# EAGLE design module_state (EAGLE 6.5.0)

## Sheet 1 of 8
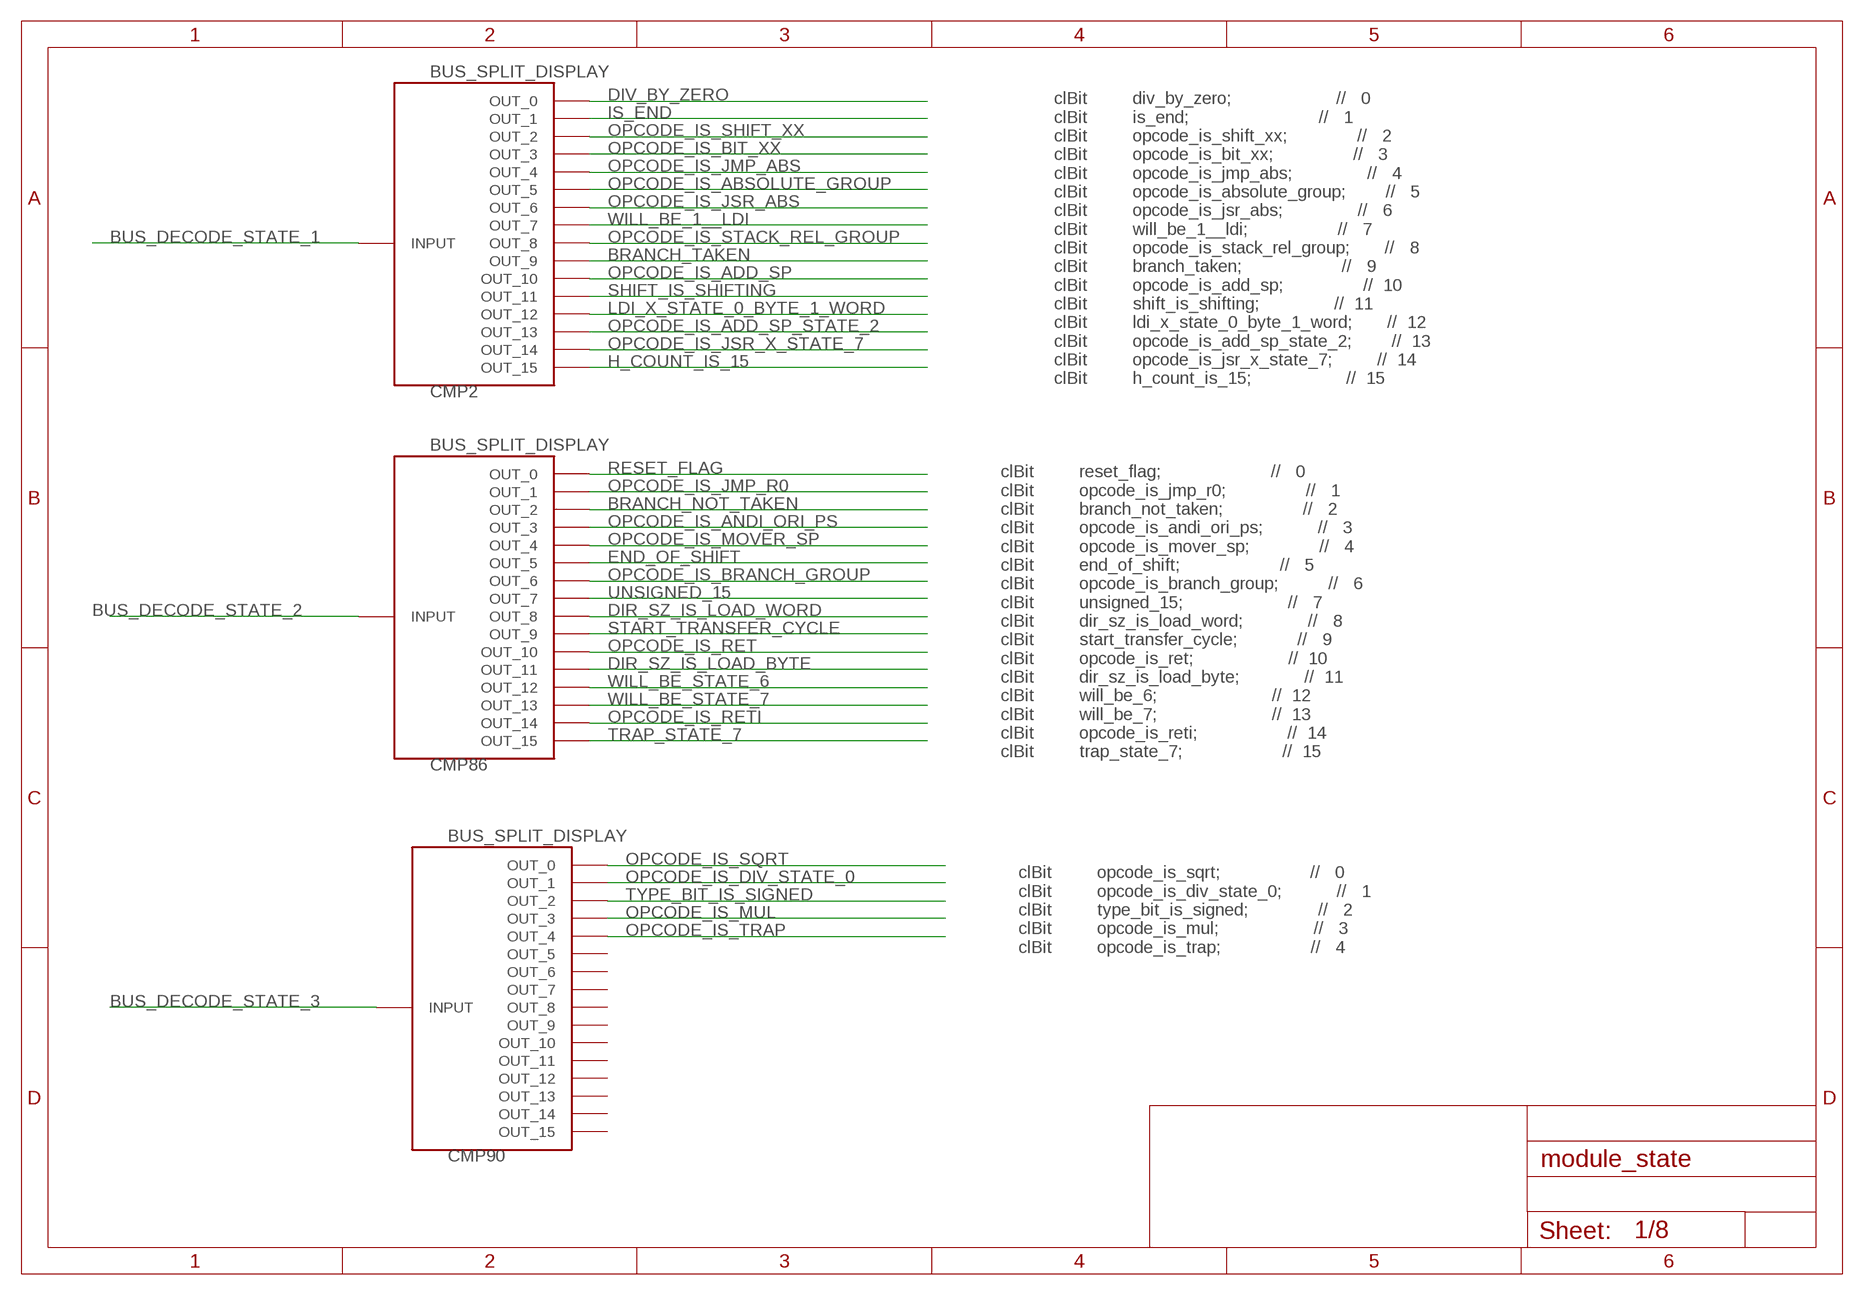
[diagram p0: schematic, sheet 1]

### Parts
CMP2  BUS_SPLIT_DISPLAY  [BUS_SPLIT_DISPLAY]
CMP86  BUS_SPLIT_DISPLAY  [BUS_SPLIT_DISPLAY]
CMP90  BUS_SPLIT_DISPLAY  [BUS_SPLIT_DISPLAY]

### Nets
BRANCH_NOT_TAKEN: CMP86.P$3(OUT_2) ; also sheet 4
BRANCH_TAKEN: CMP2.P$10(OUT_9) ; also sheet 3
BUS_DECODE_STATE_1: CMP2.INPUT
BUS_DECODE_STATE_2: CMP86.INPUT
BUS_DECODE_STATE_3: CMP90.INPUT
DIR_SZ_IS_LOAD_BYTE: CMP86.P$12(OUT_11) ; also sheet 6
DIR_SZ_IS_LOAD_WORD: CMP86.P$9(OUT_8) ; also sheet 6
DIV_BY_ZERO: CMP2.P$1(OUT_0) ; also sheet 3,7
END_OF_SHIFT: CMP86.P$6(OUT_5) ; also sheet 4
H_COUNT_IS_15: CMP2.P$16(OUT_15) ; also sheet 5,7
IS_END: CMP2.P$2(OUT_1) ; also sheet 3
LDI_X_STATE_0_BYTE_1_WORD: CMP2.P$13(OUT_12) ; also sheet 5
OPCODE_IS_ABSOLUTE_GROUP: CMP2.P$6(OUT_5) ; also sheet 3,4
OPCODE_IS_ADD_SP: CMP2.P$11(OUT_10) ; also sheet 3
OPCODE_IS_ADD_SP_STATE_2: CMP2.P$14(OUT_13) ; also sheet 5
OPCODE_IS_ANDI_ORI_PS: CMP86.P$4(OUT_3) ; also sheet 4
OPCODE_IS_BIT_XX: CMP2.P$4(OUT_3) ; also sheet 3,5
OPCODE_IS_BRANCH_GROUP: CMP86.P$7(OUT_6) ; also sheet 4
OPCODE_IS_DIV_STATE_0: CMP90.P$2(OUT_1) ; also sheet 7
OPCODE_IS_JMP_ABS: CMP2.P$5(OUT_4) ; also sheet 3,4
OPCODE_IS_JMP_R0: CMP86.P$2(OUT_1) ; also sheet 4
OPCODE_IS_JSR_ABS: CMP2.P$7(OUT_6) ; also sheet 3,8
OPCODE_IS_JSR_X_STATE_7: CMP2.P$15(OUT_14) ; also sheet 5
OPCODE_IS_MOVER_SP: CMP86.P$5(OUT_4) ; also sheet 4
OPCODE_IS_MUL: CMP90.P$4(OUT_3) ; also sheet 7
OPCODE_IS_RET: CMP86.P$11(OUT_10) ; also sheet 4,6
OPCODE_IS_RETI: CMP86.P$15(OUT_14) ; also sheet 4,6
OPCODE_IS_SHIFT_XX: CMP2.P$3(OUT_2) ; also sheet 3
OPCODE_IS_SQRT: CMP90.P$1(OUT_0) ; also sheet 7
OPCODE_IS_STACK_REL_GROUP: CMP2.P$9(OUT_8) ; also sheet 3
OPCODE_IS_TRAP: CMP90.P$5(OUT_4) ; also sheet 8
RESET_FLAG: CMP86.P$1(OUT_0) ; also sheet 4,8
SHIFT_IS_SHIFTING: CMP2.P$12(OUT_11) ; also sheet 3
START_TRANSFER_CYCLE: CMP86.P$10(OUT_9) ; also sheet 6
TRAP_STATE_7: CMP86.P$16(OUT_15) ; also sheet 2
TYPE_BIT_IS_SIGNED: CMP90.P$3(OUT_2) ; also sheet 7,8
UNSIGNED_15: CMP86.P$8(OUT_7) ; also sheet 5
WILL_BE_1__LDI: CMP2.P$8(OUT_7) ; also sheet 3
WILL_BE_STATE_6: CMP86.P$13(OUT_12) ; also sheet 2
WILL_BE_STATE_7: CMP86.P$14(OUT_13) ; also sheet 2
Unconnected: CMP90.P$6(OUT_5) CMP90.P$7(OUT_6) CMP90.P$8(OUT_7) CMP90.P$9(OUT_8) CMP90.P$10(OUT_9) CMP90.P$11(OUT_10) CMP90.P$12(OUT_11) CMP90.P$13(OUT_12) CMP90.P$14(OUT_13) CMP90.P$15(OUT_14) CMP90.P$16(OUT_15)

### Notes on the sheet
- clBit         div_by_zero;                     //   0
      clBit         is_end;                          //   1
      clBit         opcode_is_shift_xx;              //   2
      clBit         opcode_is_bit_xx;                //   3
      clBit         opcode_is_jmp_abs;               //   4
      clBit         opcode_is_absolute_group;        //   5
      clBit         opcode_is_jsr_abs;               //   6
      clBit         will_be_1__ldi;                  //   7
      clBit         opcode_is_stack_rel_group;       //   8
      clBit         branch_taken;                    //   9
      clBit         opcode_is_add_sp;                //  10
      clBit         shift_is_shifting;               //  11
      clBit         ldi_x_state_0_byte_1_word;       //  12
      clBit         opcode_is_add_sp_state_2;        //  13
      clBit         opcode_is_jsr_x_state_7;         //  14
      clBit         h_count_is_15;                   //  15
- clBit         reset_flag;                      //   0
      clBit         opcode_is_jmp_r0;                //   1
      clBit         branch_not_taken;                //   2
      clBit         opcode_is_andi_ori_ps;           //   3
      clBit         opcode_is_mover_sp;              //   4
      clBit         end_of_shift;                    //   5
      clBit         opcode_is_branch_group;          //   6
      clBit         unsigned_15;                     //   7
      clBit         dir_sz_is_load_word;             //   8
      clBit         start_transfer_cycle;            //   9
      clBit         opcode_is_ret;                   //  10
      clBit         dir_sz_is_load_byte;             //  11
      clBit         will_be_6;                       //  12
      clBit         will_be_7;                       //  13
      clBit         opcode_is_reti;                  //  14
      clBit         trap_state_7;                    //  15
- clBit         opcode_is_sqrt;                  //   0
      clBit         opcode_is_div_state_0;           //   1
      clBit         type_bit_is_signed;              //   2
      clBit         opcode_is_mul;                   //   3
      clBit         opcode_is_trap;                  //   4

## Sheet 2 of 8
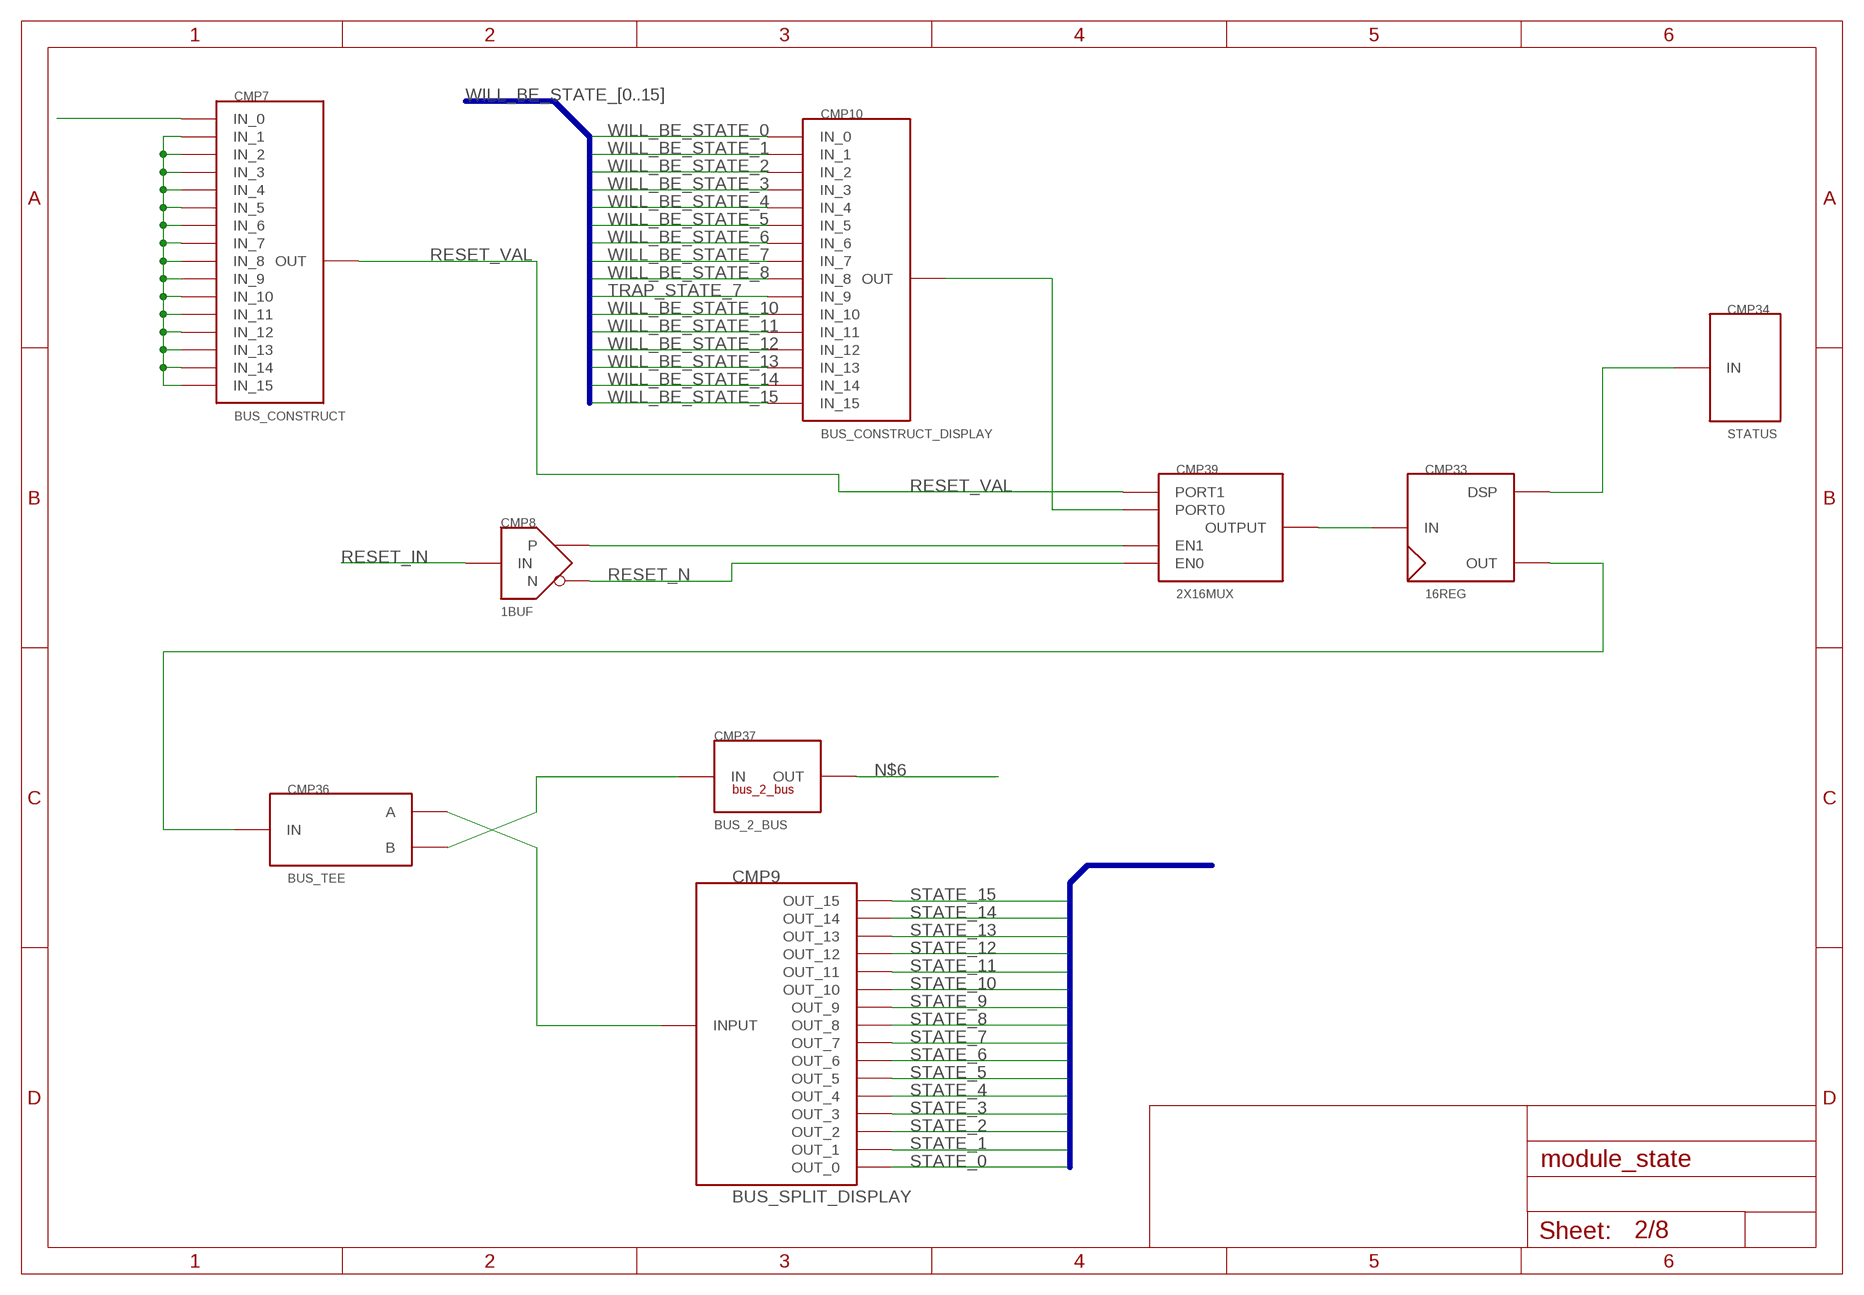
[diagram p1: schematic, sheet 2]

### Parts
CMP7  BUS_CONSTRUCT  [BUS_SPLIT]
CMP8  1BUF  [1BUF]
CMP9  BUS_SPLIT_DISPLAY  [BUS_SPLIT_DISPLAY]
CMP10  BUS_CONSTRUCT_DISPLAY  [BUS_SPLIT_DISPLAY]
CMP33  16REG  [16REG]
CMP34  STATUS  [STATUS]
CMP36  BUS_TEE  [BUS_TEE]
CMP37  BUS_2_BUS  [BUS2BUS]
CMP39  2X16MUX  [2X16MUX]

### Nets
N$1: CMP33.DISPLAY(DSP) CMP34.P$1(IN)
N$2: CMP33.OUT CMP36.INPUT(IN)
N$3: CMP36.OUTB(B) CMP37.P$1(IN)
N$4: CMP7.P$1(IN_0)
N$5: CMP7.P$2(IN_1) CMP7.P$3(IN_2) CMP7.P$4(IN_3) CMP7.P$5(IN_4) CMP7.P$6(IN_5) CMP7.P$7(IN_6) CMP7.P$8(IN_7) CMP7.P$9(IN_8) CMP7.P$10(IN_9) CMP7.P$11(IN_10) CMP7.P$12(IN_11) CMP7.P$13(IN_12) CMP7.P$14(IN_13) CMP7.P$15(IN_14) CMP7.P$16(IN_15)
N$6: CMP37.P$2(OUT)
N$7: CMP9.INPUT CMP36.OUT_A(A)
N$8: CMP10.INPUT(OUT) CMP39.PORT0
N$9: CMP33.INPUT(IN) CMP39.OUT(OUTPUT)
N$13: CMP8.P CMP39.EN1
RESET_IN: CMP8.IN
RESET_N: CMP8.N CMP39.EN0
RESET_VAL: CMP7.INPUT(OUT) CMP39.PORT1
STATE_0: CMP9.P$1(OUT_0) ; also sheet 3,5,6,7,8
STATE_1: CMP9.P$2(OUT_1) ; also sheet 3,5,8
STATE_2: CMP9.P$3(OUT_2) ; also sheet 5
STATE_3: CMP9.P$4(OUT_3)
STATE_4: CMP9.P$5(OUT_4) ; also sheet 6
STATE_5: CMP9.P$6(OUT_5) ; also sheet 4,5
STATE_6: CMP9.P$7(OUT_6)
STATE_7: CMP9.P$8(OUT_7) ; also sheet 4
STATE_8: CMP9.P$9(OUT_8) ; also sheet 6
STATE_9: CMP9.P$10(OUT_9) ; also sheet 5
STATE_10: CMP9.P$11(OUT_10) ; also sheet 5,7
STATE_11: CMP9.P$12(OUT_11) ; also sheet 5,7
STATE_12: CMP9.P$13(OUT_12) ; also sheet 5
STATE_13: CMP9.P$14(OUT_13) ; also sheet 5,7,8
STATE_14: CMP9.P$15(OUT_14) ; also sheet 5
STATE_15: CMP9.P$16(OUT_15)
TRAP_STATE_7: CMP10.P$10(IN_9) ; also sheet 1
WILL_BE_STATE_0: CMP10.P$1(IN_0) ; also sheet 3
WILL_BE_STATE_1: CMP10.P$2(IN_1) ; also sheet 3
WILL_BE_STATE_2: CMP10.P$3(IN_2) ; also sheet 3
WILL_BE_STATE_3: CMP10.P$4(IN_3) ; also sheet 5
WILL_BE_STATE_4: CMP10.P$5(IN_4) ; also sheet 6
WILL_BE_STATE_5: CMP10.P$6(IN_5) ; also sheet 6
WILL_BE_STATE_6: CMP10.P$7(IN_6) ; also sheet 1
WILL_BE_STATE_7: CMP10.P$8(IN_7) ; also sheet 1
WILL_BE_STATE_8: CMP10.P$9(IN_8) ; also sheet 6
WILL_BE_STATE_10: CMP10.P$11(IN_10) ; also sheet 7
WILL_BE_STATE_11: CMP10.P$12(IN_11) ; also sheet 7
WILL_BE_STATE_12: CMP10.P$13(IN_12) ; also sheet 7
WILL_BE_STATE_13: CMP10.P$14(IN_13) ; also sheet 7
WILL_BE_STATE_14: CMP10.P$15(IN_14) ; also sheet 8
WILL_BE_STATE_15: CMP10.P$16(IN_15) ; also sheet 8

### Buses
WILL_BE_STATE_[0..15]
STATE_[0..15]

## Sheet 3 of 8
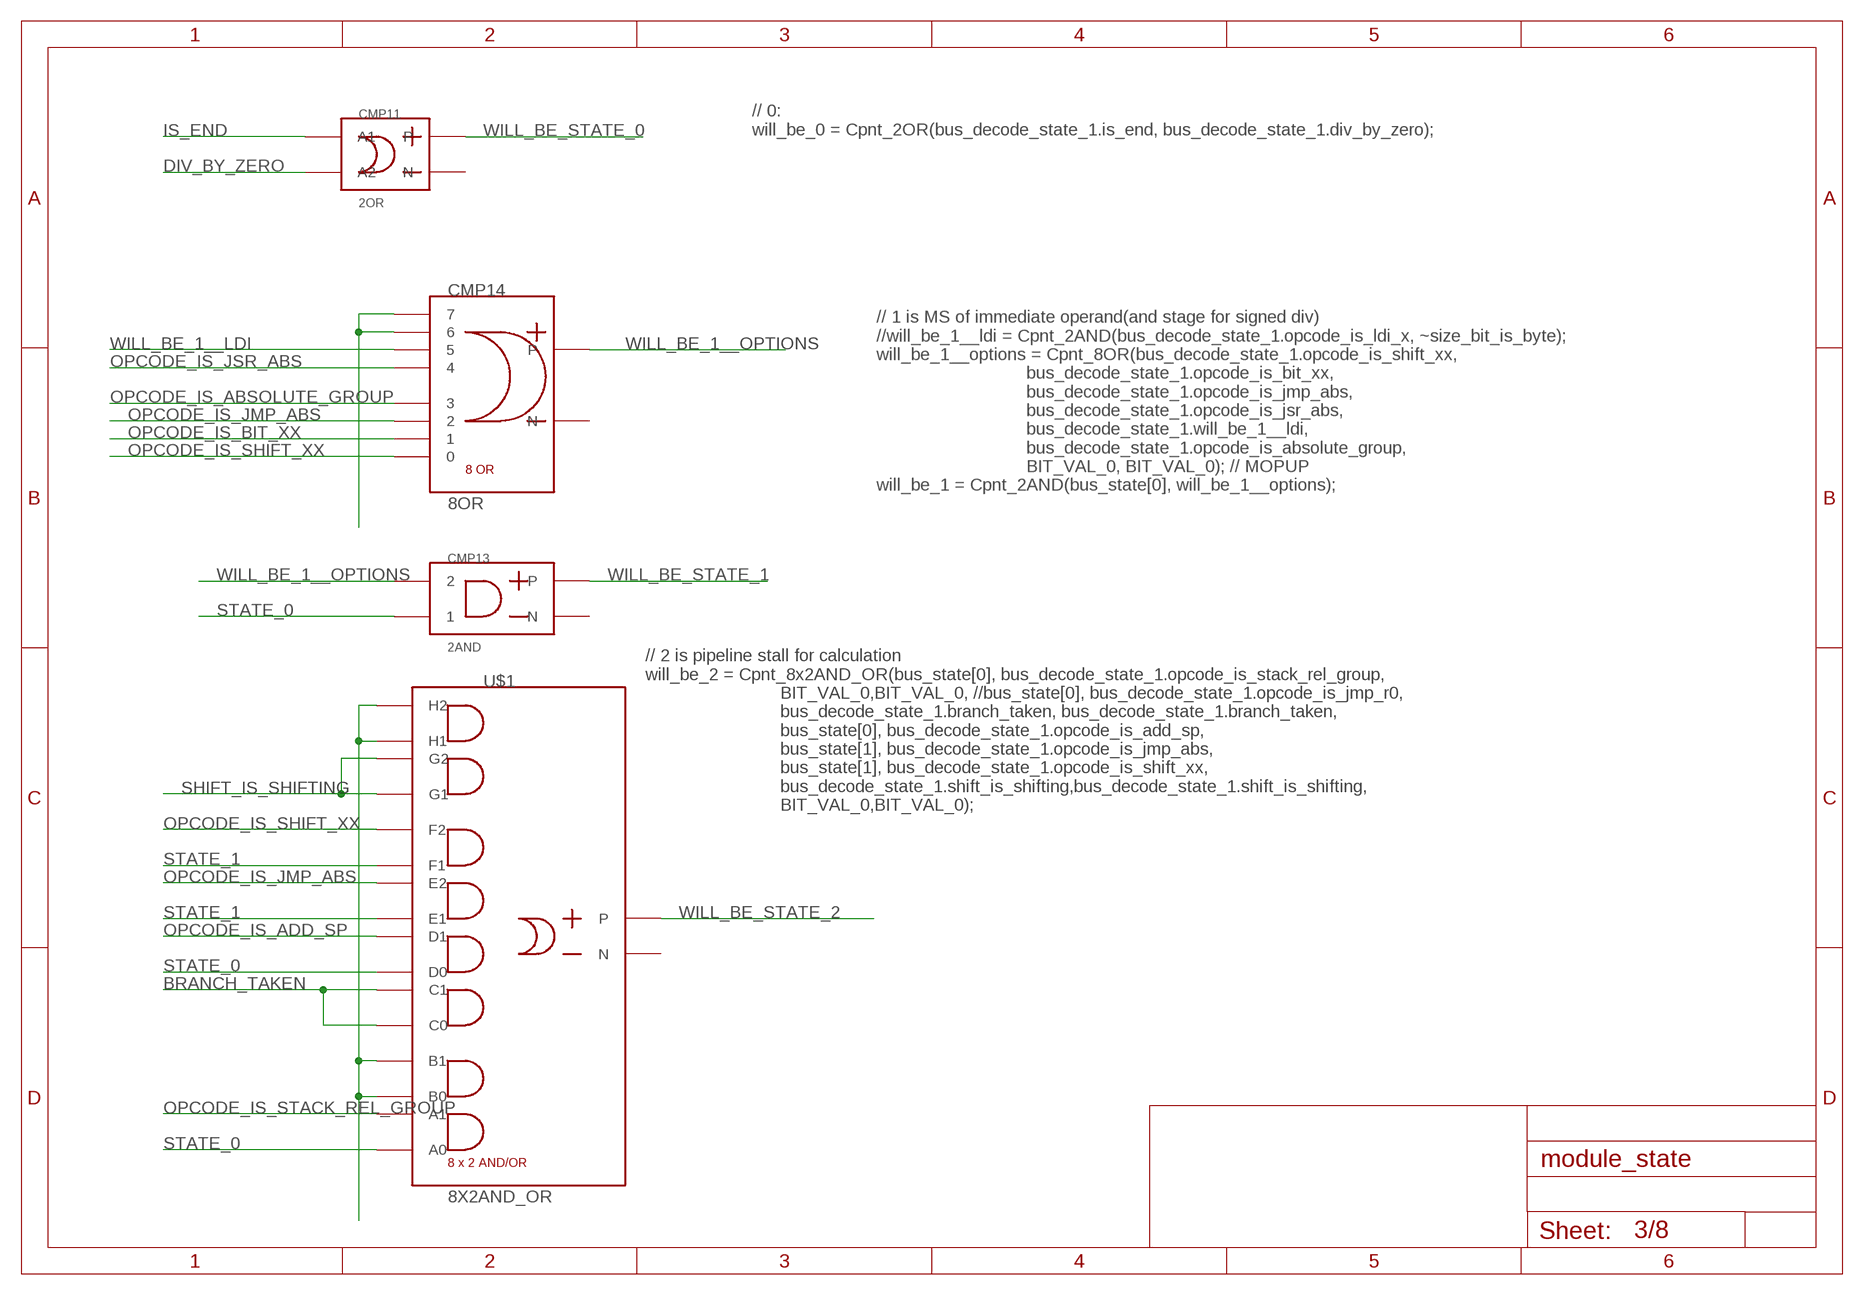
[diagram p2: schematic, sheet 3]

### Parts
CMP11  2OR  [2OR]
CMP13  2AND  [2AND]
CMP14  8OR  [8OR]
U$1  8X2AND_OR  [8X2AND_OR]

### Nets
BRANCH_TAKEN: U$1.P$5(C0) U$1.P$6(C1) ; also sheet 1
DIV_BY_ZERO: CMP11.P$1(A2) ; also sheet 1,7
IS_END: CMP11.P$2(A1) ; also sheet 1
N$10: U$1.P$3(B0) U$1.P$4(B1) U$1.P$15(H1) U$1.P$16(H2)
N$11: CMP14.7 CMP14.8
OPCODE_IS_ABSOLUTE_GROUP: CMP14.4 ; also sheet 1,4
OPCODE_IS_ADD_SP: U$1.P$8(D1) ; also sheet 1
OPCODE_IS_BIT_XX: CMP14.2 ; also sheet 1,5
OPCODE_IS_JMP_ABS: CMP14.3 U$1.P$10(E2) ; also sheet 1,4
OPCODE_IS_JSR_ABS: CMP14.5 ; also sheet 1,8
OPCODE_IS_SHIFT_XX: CMP14.1 U$1.P$12(F2) ; also sheet 1
OPCODE_IS_STACK_REL_GROUP: U$1.P$2(A1) ; also sheet 1
SHIFT_IS_SHIFTING: U$1.P$13(G1) U$1.P$14(G2) ; also sheet 1
STATE_0: CMP13.P$1 U$1.P$1(A0) U$1.P$7(D0) ; also sheet 2,5,6,7,8
STATE_1: U$1.P$9(E1) U$1.P$11(F1) ; also sheet 2,5,8
WILL_BE_1__LDI: CMP14.6 ; also sheet 1
WILL_BE_1__OPTIONS: CMP13.P$2 CMP14.OUT_P(P)
WILL_BE_STATE_0: CMP11.OUT_P(P) ; also sheet 2
WILL_BE_STATE_1: CMP13.OUT_P(P) ; also sheet 2
WILL_BE_STATE_2: U$1.OUT_P(P) ; also sheet 2
Unconnected: CMP11.OUT_M(N) CMP13.OUT_M(N) CMP14.OUT_M(N) U$1.OUT_M(N)

### Notes on the sheet
- // 0:
      will_be_0 = Cpnt_2OR(bus_decode_state_1.is_end, bus_decode_state_1.div_by_zero);
- // 1 is MS of immediate operand(and stage for signed div)
      //will_be_1__ldi = Cpnt_2AND(bus_decode_state_1.opcode_is_ldi_x, ~size_bit_is_byte);
      will_be_1__options = Cpnt_8OR(bus_decode_state_1.opcode_is_shift_xx,
                                    bus_decode_state_1.opcode_is_bit_xx,
                                    bus_decode_state_1.opcode_is_jmp_abs,
                                    bus_decode_state_1.opcode_is_jsr_abs,
                                    bus_decode_state_1.will_be_1__ldi,
                                    bus_decode_state_1.opcode_is_absolute_group,
                                    BIT_VAL_0, BIT_VAL_0); // MOPUP
      will_be_1 = Cpnt_2AND(bus_state[0], will_be_1__options);
- // 2 is pipeline stall for calculation
      will_be_2 = Cpnt_8x2AND_OR(bus_state[0], bus_decode_state_1.opcode_is_stack_rel_group,
                                 BIT_VAL_0,BIT_VAL_0, //bus_state[0], bus_decode_state_1.opcode_is_jmp_r0,
                                 bus_decode_state_1.branch_taken, bus_decode_state_1.branch_taken,
                                 bus_state[0], bus_decode_state_1.opcode_is_add_sp,
                                 bus_state[1], bus_decode_state_1.opcode_is_jmp_abs,
                                 bus_state[1], bus_decode_state_1.opcode_is_shift_xx,
                                 bus_decode_state_1.shift_is_shifting,bus_decode_state_1.shift_is_shifting,
                                 BIT_VAL_0,BIT_VAL_0);

## Sheet 4 of 8
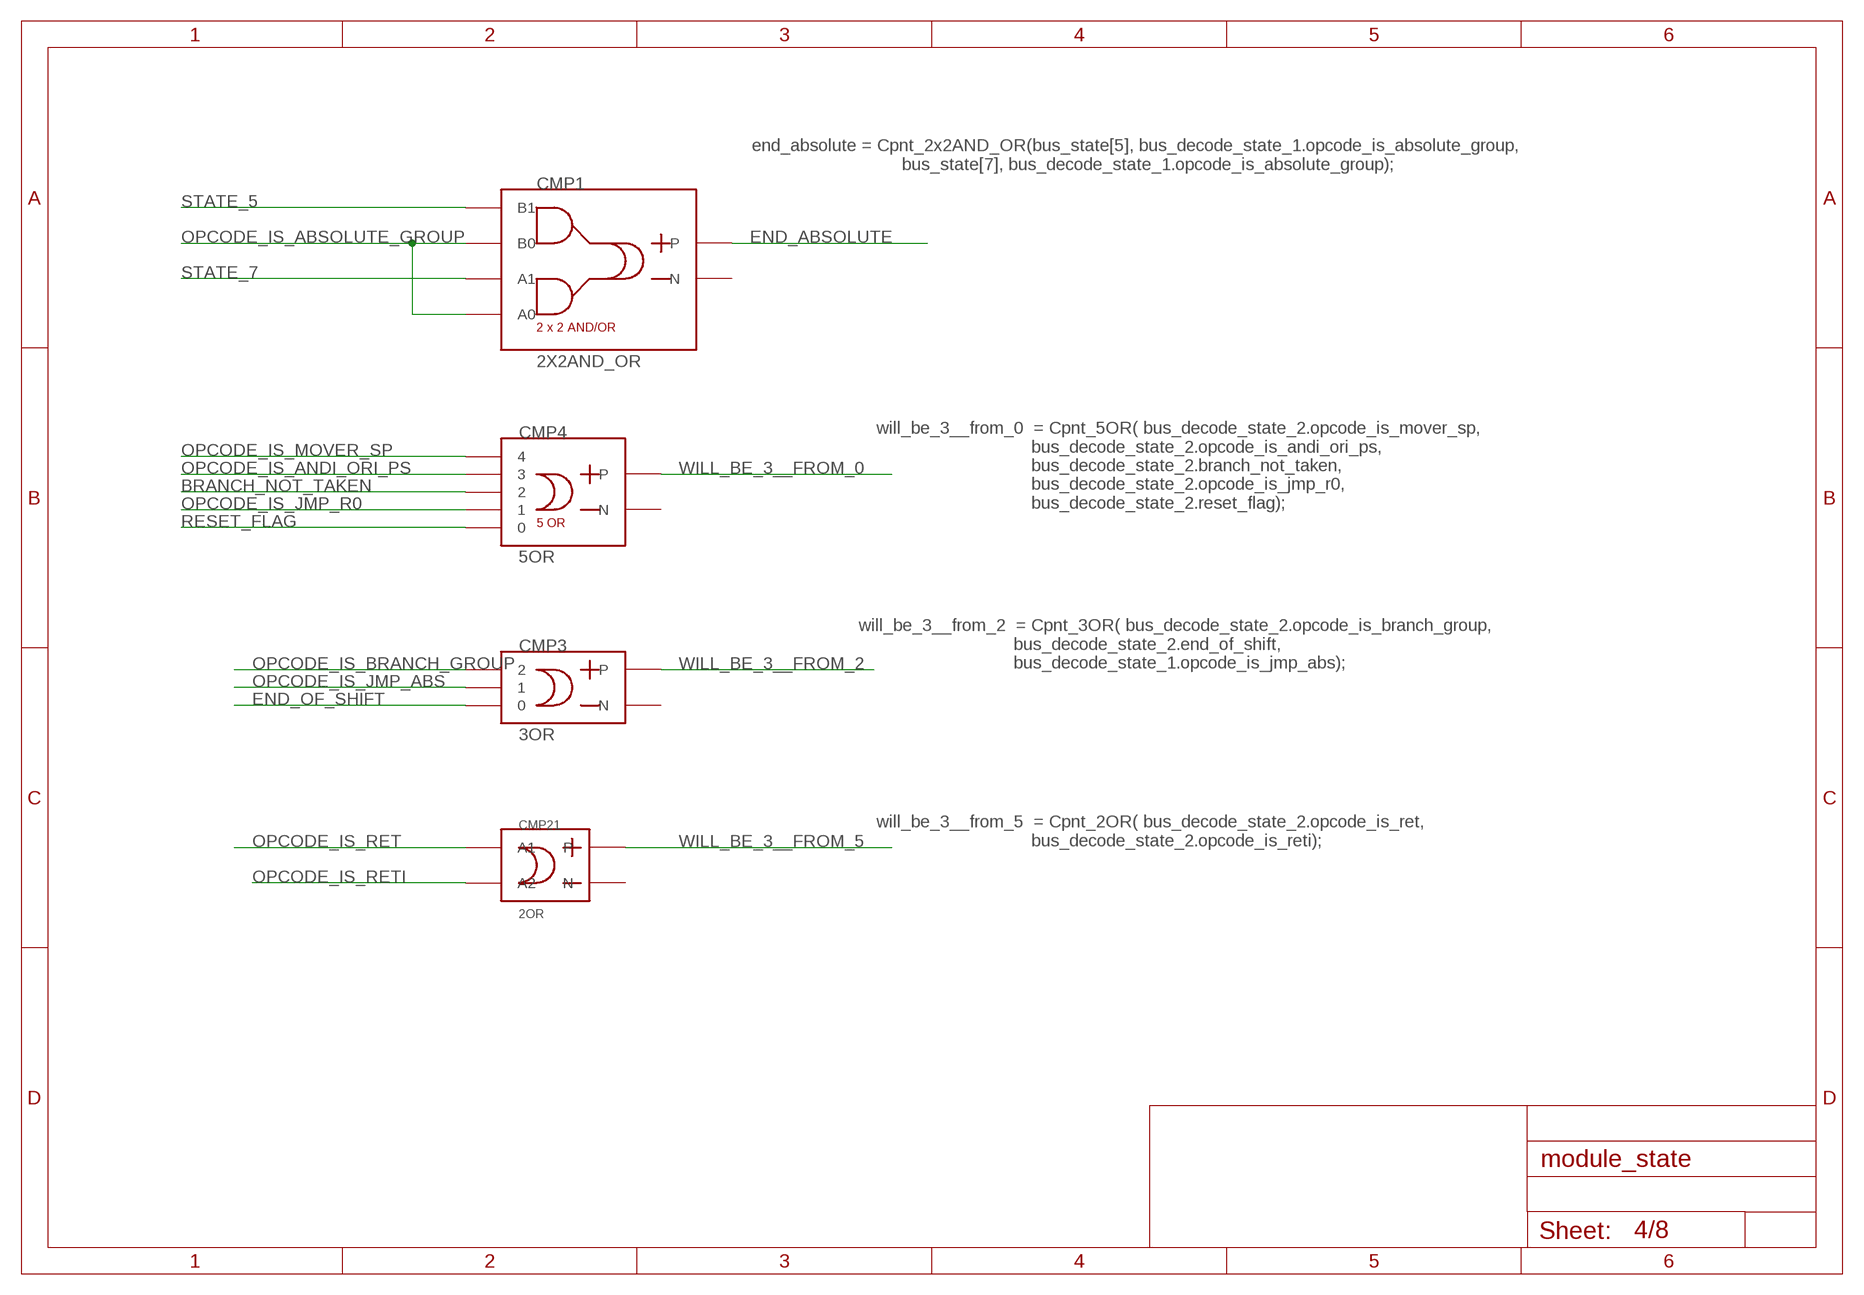
[diagram p3: schematic, sheet 4]

### Parts
CMP1  2X2AND_OR  [2X2AND_OR]
CMP3  3OR  [3OR]
CMP4  5OR  [5OR]
CMP21  2OR  [2OR]

### Nets
BRANCH_NOT_TAKEN: CMP4.3 ; also sheet 1
END_ABSOLUTE: CMP1.OUT_P(P) ; also sheet 5
END_OF_SHIFT: CMP3.P$1 ; also sheet 1
OPCODE_IS_ABSOLUTE_GROUP: CMP1.P$1(A0) CMP1.P$3(B0) ; also sheet 1,3
OPCODE_IS_ANDI_ORI_PS: CMP4.4 ; also sheet 1
OPCODE_IS_BRANCH_GROUP: CMP3.P$3 ; also sheet 1
OPCODE_IS_JMP_ABS: CMP3.P$2 ; also sheet 1,3
OPCODE_IS_JMP_R0: CMP4.2 ; also sheet 1
OPCODE_IS_MOVER_SP: CMP4.5 ; also sheet 1
OPCODE_IS_RET: CMP21.P$1(A2) ; also sheet 1,6
OPCODE_IS_RETI: CMP21.P$2(A1) ; also sheet 1,6
RESET_FLAG: CMP4.1 ; also sheet 1,8
STATE_5: CMP1.P$4(B1) ; also sheet 2,5
STATE_7: CMP1.P$2(A1) ; also sheet 2
WILL_BE_3__FROM_0: CMP4.OUT_P(P) ; also sheet 5
WILL_BE_3__FROM_2: CMP3.OUT_P(P) ; also sheet 5
WILL_BE_3__FROM_5: CMP21.OUT_P(P) ; also sheet 5
Unconnected: CMP1.OUT_M(N) CMP3.OUT_M(N) CMP4.OUT_M(N) CMP21.OUT_M(N)

### Notes on the sheet
- end_absolute = Cpnt_2x2AND_OR(bus_state[5], bus_decode_state_1.opcode_is_absolute_group,
                                    bus_state[7], bus_decode_state_1.opcode_is_absolute_group);
- will_be_3__from_0  = Cpnt_5OR( bus_decode_state_2.opcode_is_mover_sp,
                                     bus_decode_state_2.opcode_is_andi_ori_ps,
                                     bus_decode_state_2.branch_not_taken,
                                     bus_decode_state_2.opcode_is_jmp_r0,
                                     bus_decode_state_2.reset_flag);
- will_be_3__from_2  = Cpnt_3OR( bus_decode_state_2.opcode_is_branch_group,
                                     bus_decode_state_2.end_of_shift,
                                     bus_decode_state_1.opcode_is_jmp_abs);
- will_be_3__from_5  = Cpnt_2OR( bus_decode_state_2.opcode_is_ret,
                                     bus_decode_state_2.opcode_is_reti);

## Sheet 5 of 8
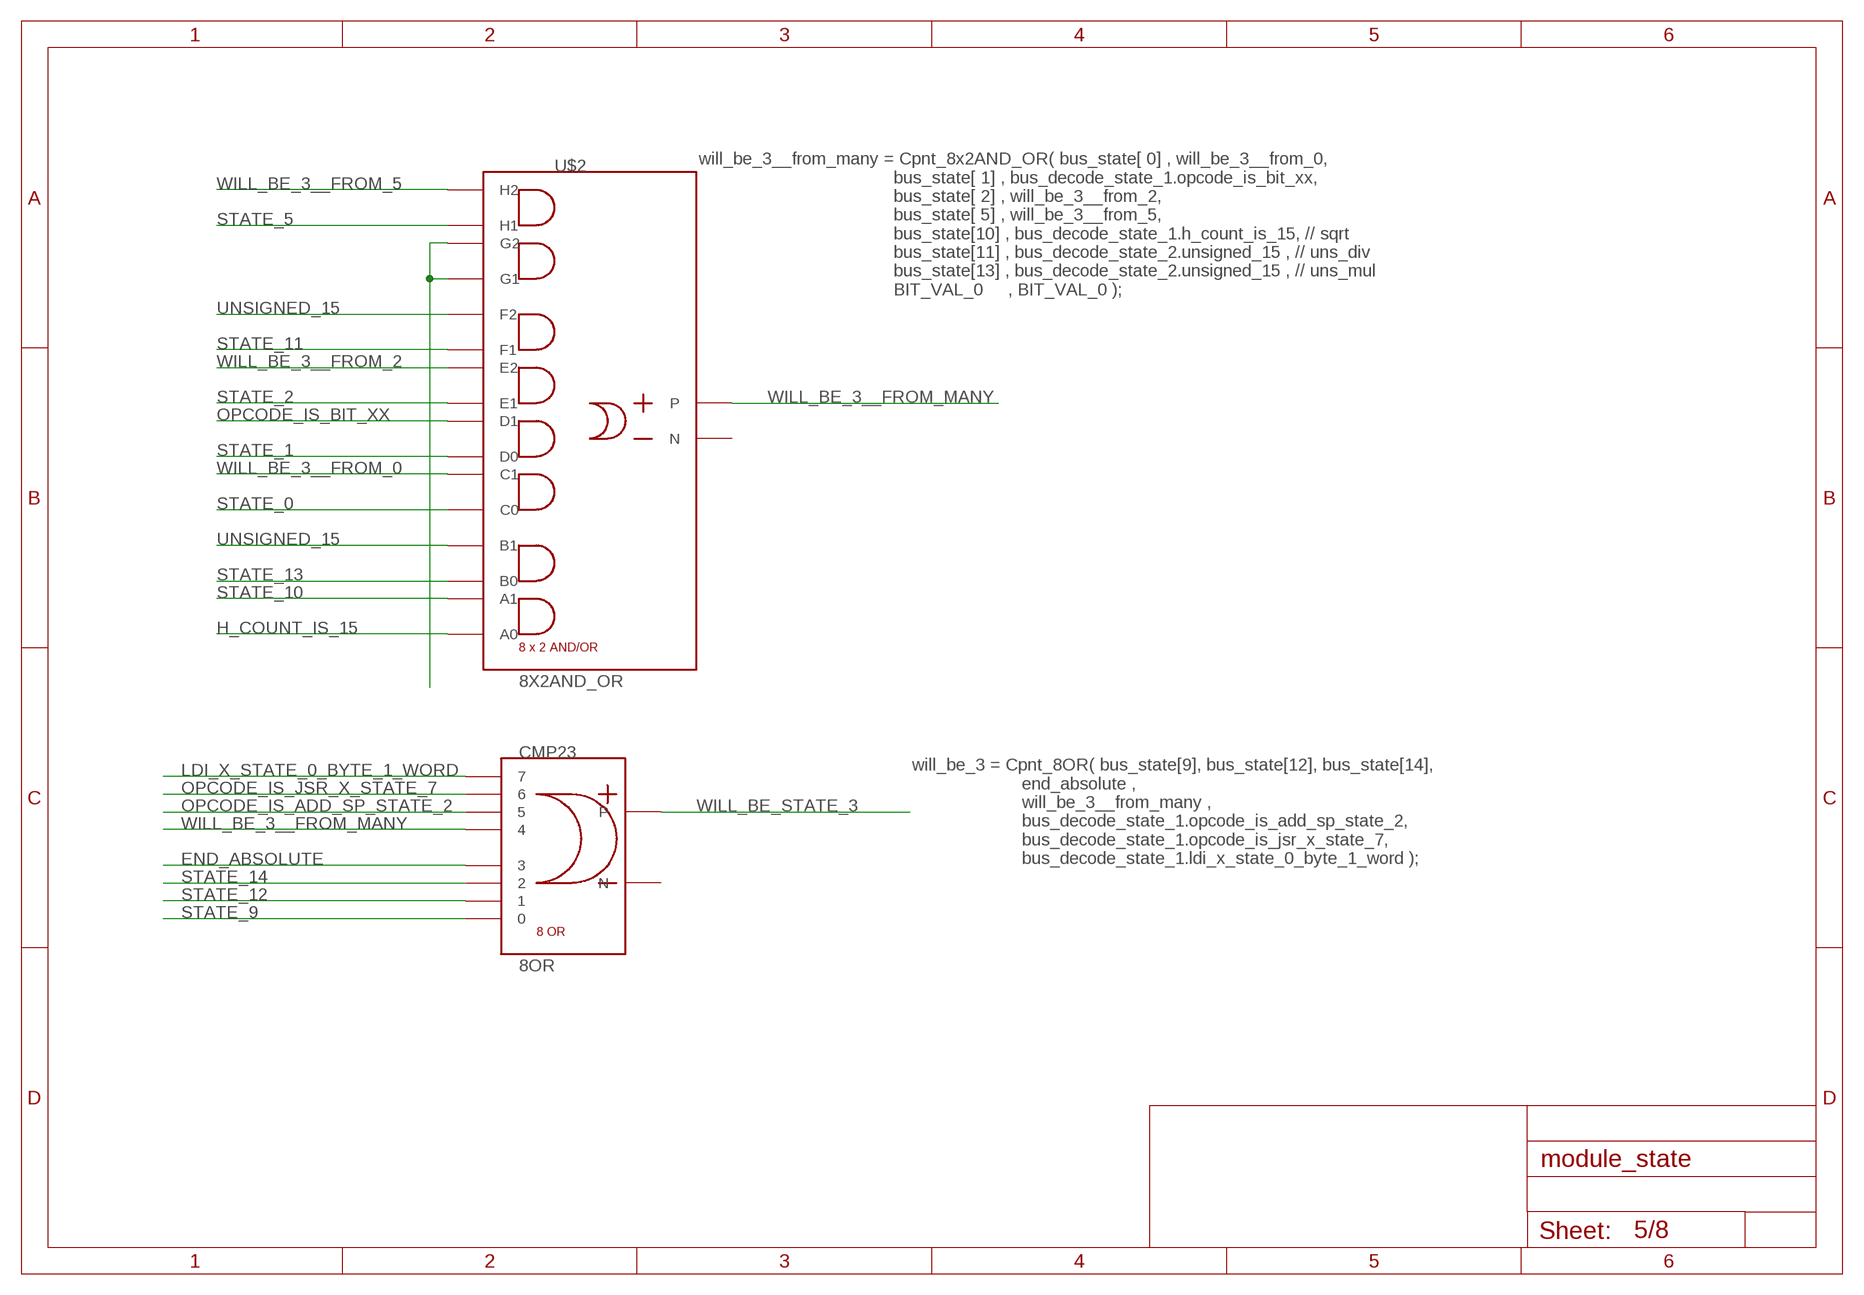
[diagram p4: schematic, sheet 5]

### Parts
CMP23  8OR  [8OR]
U$2  8X2AND_OR  [8X2AND_OR]

### Nets
END_ABSOLUTE: CMP23.8 ; also sheet 4
H_COUNT_IS_15: U$2.P$1(A0) ; also sheet 1,7
LDI_X_STATE_0_BYTE_1_WORD: CMP23.4 ; also sheet 1
N$15: U$2.P$13(G1) U$2.P$14(G2)
OPCODE_IS_ADD_SP_STATE_2: CMP23.5 ; also sheet 1
OPCODE_IS_BIT_XX: U$2.P$8(D1) ; also sheet 1,3
OPCODE_IS_JSR_X_STATE_7: CMP23.6 ; also sheet 1
STATE_0: U$2.P$5(C0) ; also sheet 2,3,6,7,8
STATE_1: U$2.P$7(D0) ; also sheet 2,3,8
STATE_2: U$2.P$9(E1) ; also sheet 2
STATE_5: U$2.P$15(H1) ; also sheet 2,4
STATE_9: CMP23.1 ; also sheet 2
STATE_10: U$2.P$2(A1) ; also sheet 2,7
STATE_11: U$2.P$11(F1) ; also sheet 2,7
STATE_12: CMP23.2 ; also sheet 2
STATE_13: U$2.P$3(B0) ; also sheet 2,7,8
STATE_14: CMP23.3 ; also sheet 2
UNSIGNED_15: U$2.P$4(B1) U$2.P$12(F2) ; also sheet 1
WILL_BE_3__FROM_0: U$2.P$6(C1) ; also sheet 4
WILL_BE_3__FROM_2: U$2.P$10(E2) ; also sheet 4
WILL_BE_3__FROM_5: U$2.P$16(H2) ; also sheet 4
WILL_BE_3__FROM_MANY: CMP23.7 U$2.OUT_P(P)
WILL_BE_STATE_3: CMP23.OUT_P(P) ; also sheet 2
Unconnected: CMP23.OUT_M(N) U$2.OUT_M(N)

### Notes on the sheet
- will_be_3__from_many = Cpnt_8x2AND_OR( bus_state[ 0] , will_be_3__from_0,
                                             bus_state[ 1] , bus_decode_state_1.opcode_is_bit_xx,
                                             bus_state[ 2] , will_be_3__from_2,
                                             bus_state[ 5] , will_be_3__from_5,
                                             bus_state[10] , bus_decode_state_1.h_count_is_15, // sqrt
                                             bus_state[11] , bus_decode_state_2.unsigned_15 , // uns_div
                                             bus_state[13] , bus_decode_state_2.unsigned_15 , // uns_mul
                                             BIT_VAL_0     , BIT_VAL_0 );
- will_be_3 = Cpnt_8OR( bus_state[9], bus_state[12], bus_state[14],
                            end_absolute ,
                            will_be_3__from_many ,
                            bus_decode_state_1.opcode_is_add_sp_state_2, 
                            bus_decode_state_1.opcode_is_jsr_x_state_7,
                            bus_decode_state_1.ldi_x_state_0_byte_1_word );

## Sheet 6 of 8
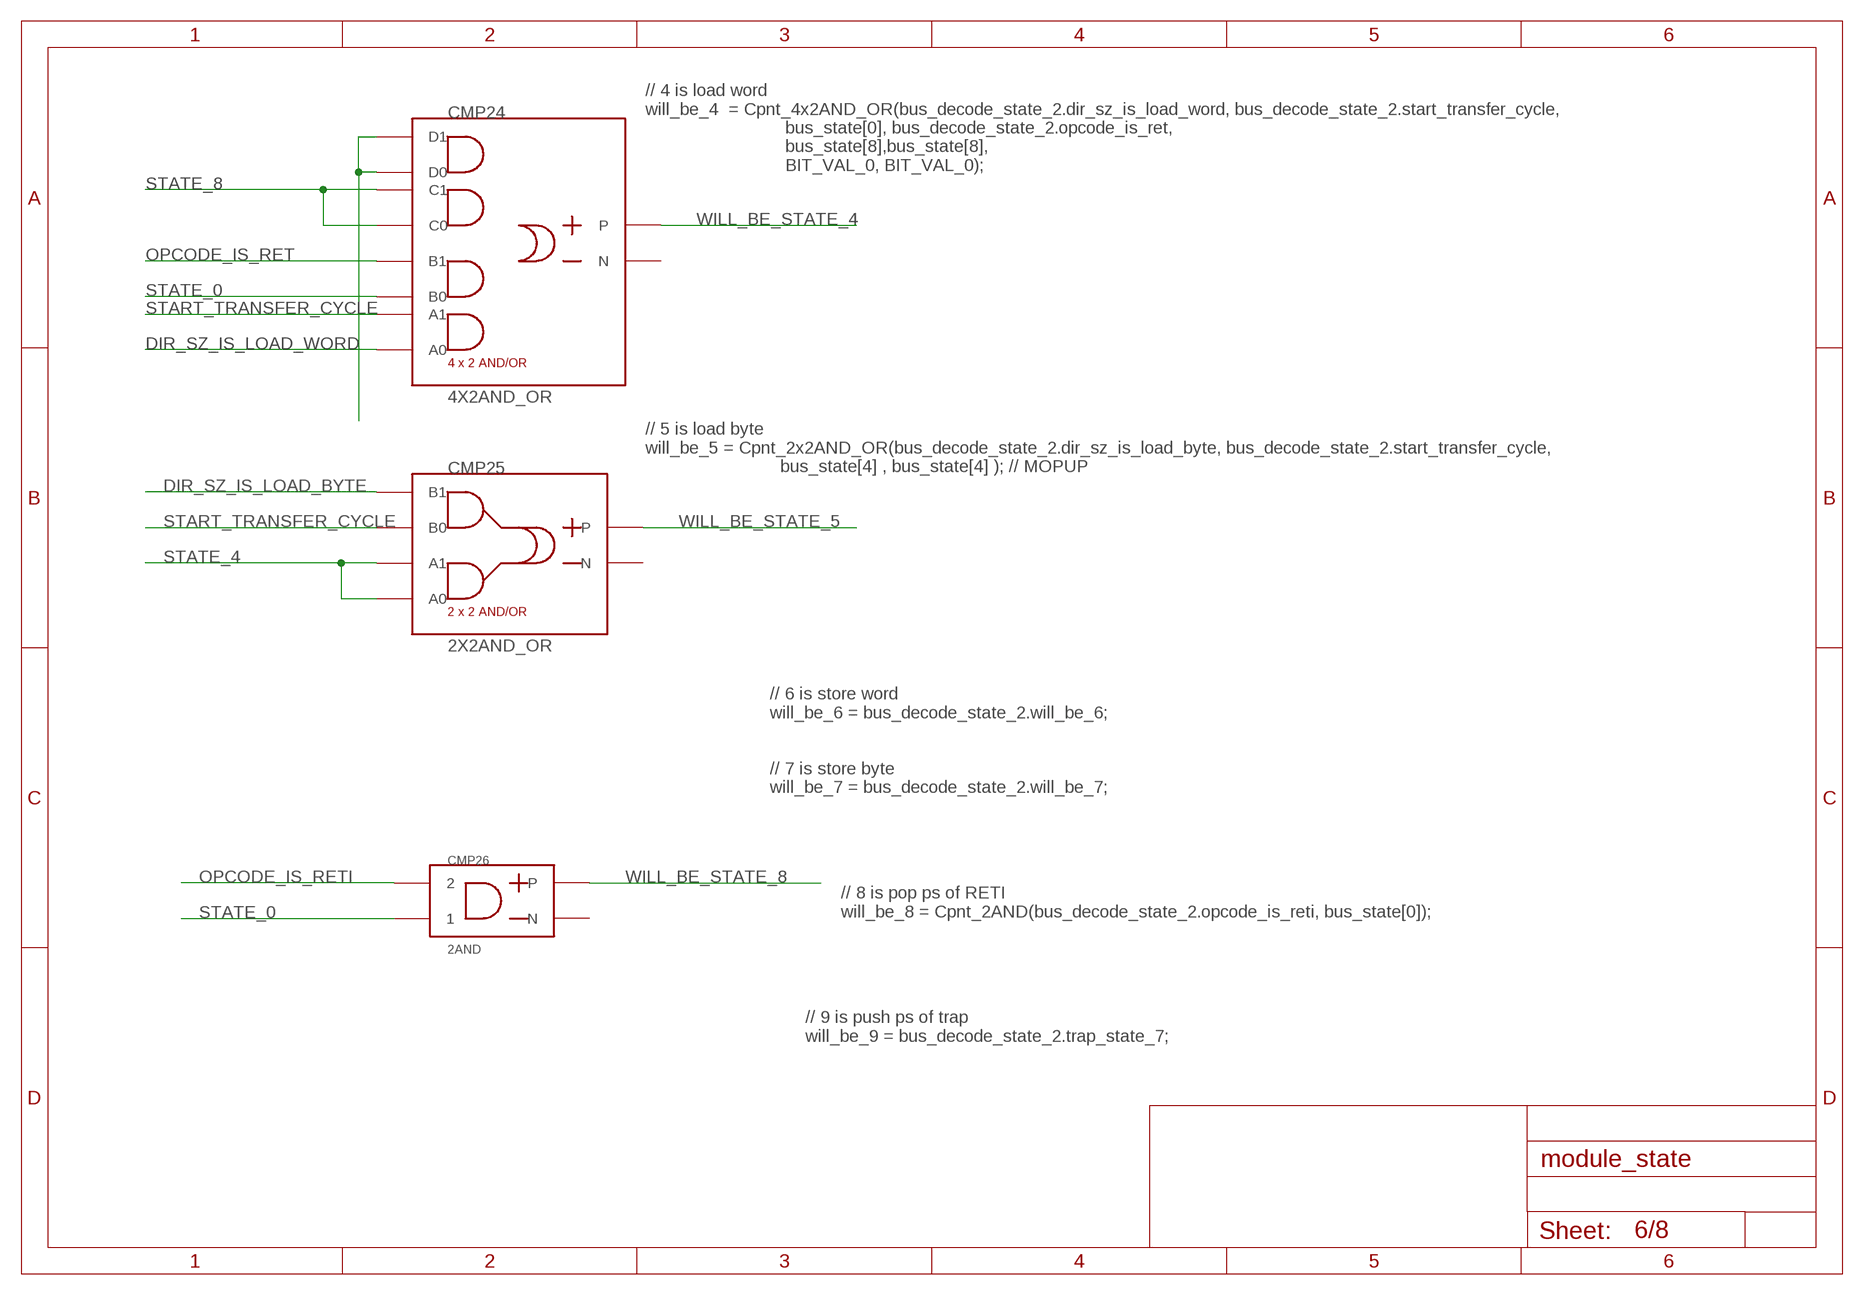
[diagram p5: schematic, sheet 6]

### Parts
CMP24  4X2AND_OR  [4X2AND_OR]
CMP25  2X2AND_OR  [2X2AND_OR]
CMP26  2AND  [2AND]

### Nets
DIR_SZ_IS_LOAD_BYTE: CMP25.P$4(B1) ; also sheet 1
DIR_SZ_IS_LOAD_WORD: CMP24.P$1(A0) ; also sheet 1
N$14: CMP24.P$7(D0) CMP24.P$8(D1)
OPCODE_IS_RET: CMP24.P$4(B1) ; also sheet 1,4
OPCODE_IS_RETI: CMP26.P$2 ; also sheet 1,4
START_TRANSFER_CYCLE: CMP24.P$2(A1) CMP25.P$3(B0) ; also sheet 1
STATE_0: CMP24.P$3(B0) CMP26.P$1 ; also sheet 2,3,5,7,8
STATE_4: CMP25.P$1(A0) CMP25.P$2(A1) ; also sheet 2
STATE_8: CMP24.P$5(C0) CMP24.P$6(C1) ; also sheet 2
WILL_BE_STATE_4: CMP24.OUT_P(P) ; also sheet 2
WILL_BE_STATE_5: CMP25.OUT_P(P) ; also sheet 2
WILL_BE_STATE_8: CMP26.OUT_P(P) ; also sheet 2
Unconnected: CMP24.OUT_M(N) CMP25.OUT_M(N) CMP26.OUT_M(N)

### Notes on the sheet
- // 4 is load word
      will_be_4  = Cpnt_4x2AND_OR(bus_decode_state_2.dir_sz_is_load_word, bus_decode_state_2.start_transfer_cycle,
                                  bus_state[0], bus_decode_state_2.opcode_is_ret,
                                  bus_state[8],bus_state[8],
                                  BIT_VAL_0, BIT_VAL_0);
- // 5 is load byte
      will_be_5 = Cpnt_2x2AND_OR(bus_decode_state_2.dir_sz_is_load_byte, bus_decode_state_2.start_transfer_cycle,
                                 bus_state[4] , bus_state[4] ); // MOPUP
- // 6 is store word
      will_be_6 = bus_decode_state_2.will_be_6;
  
  
      // 7 is store byte
      will_be_7 = bus_decode_state_2.will_be_7;
- // 8 is pop ps of RETI
      will_be_8 = Cpnt_2AND(bus_decode_state_2.opcode_is_reti, bus_state[0]);
- // 9 is push ps of trap
      will_be_9 = bus_decode_state_2.trap_state_7;

## Sheet 7 of 8
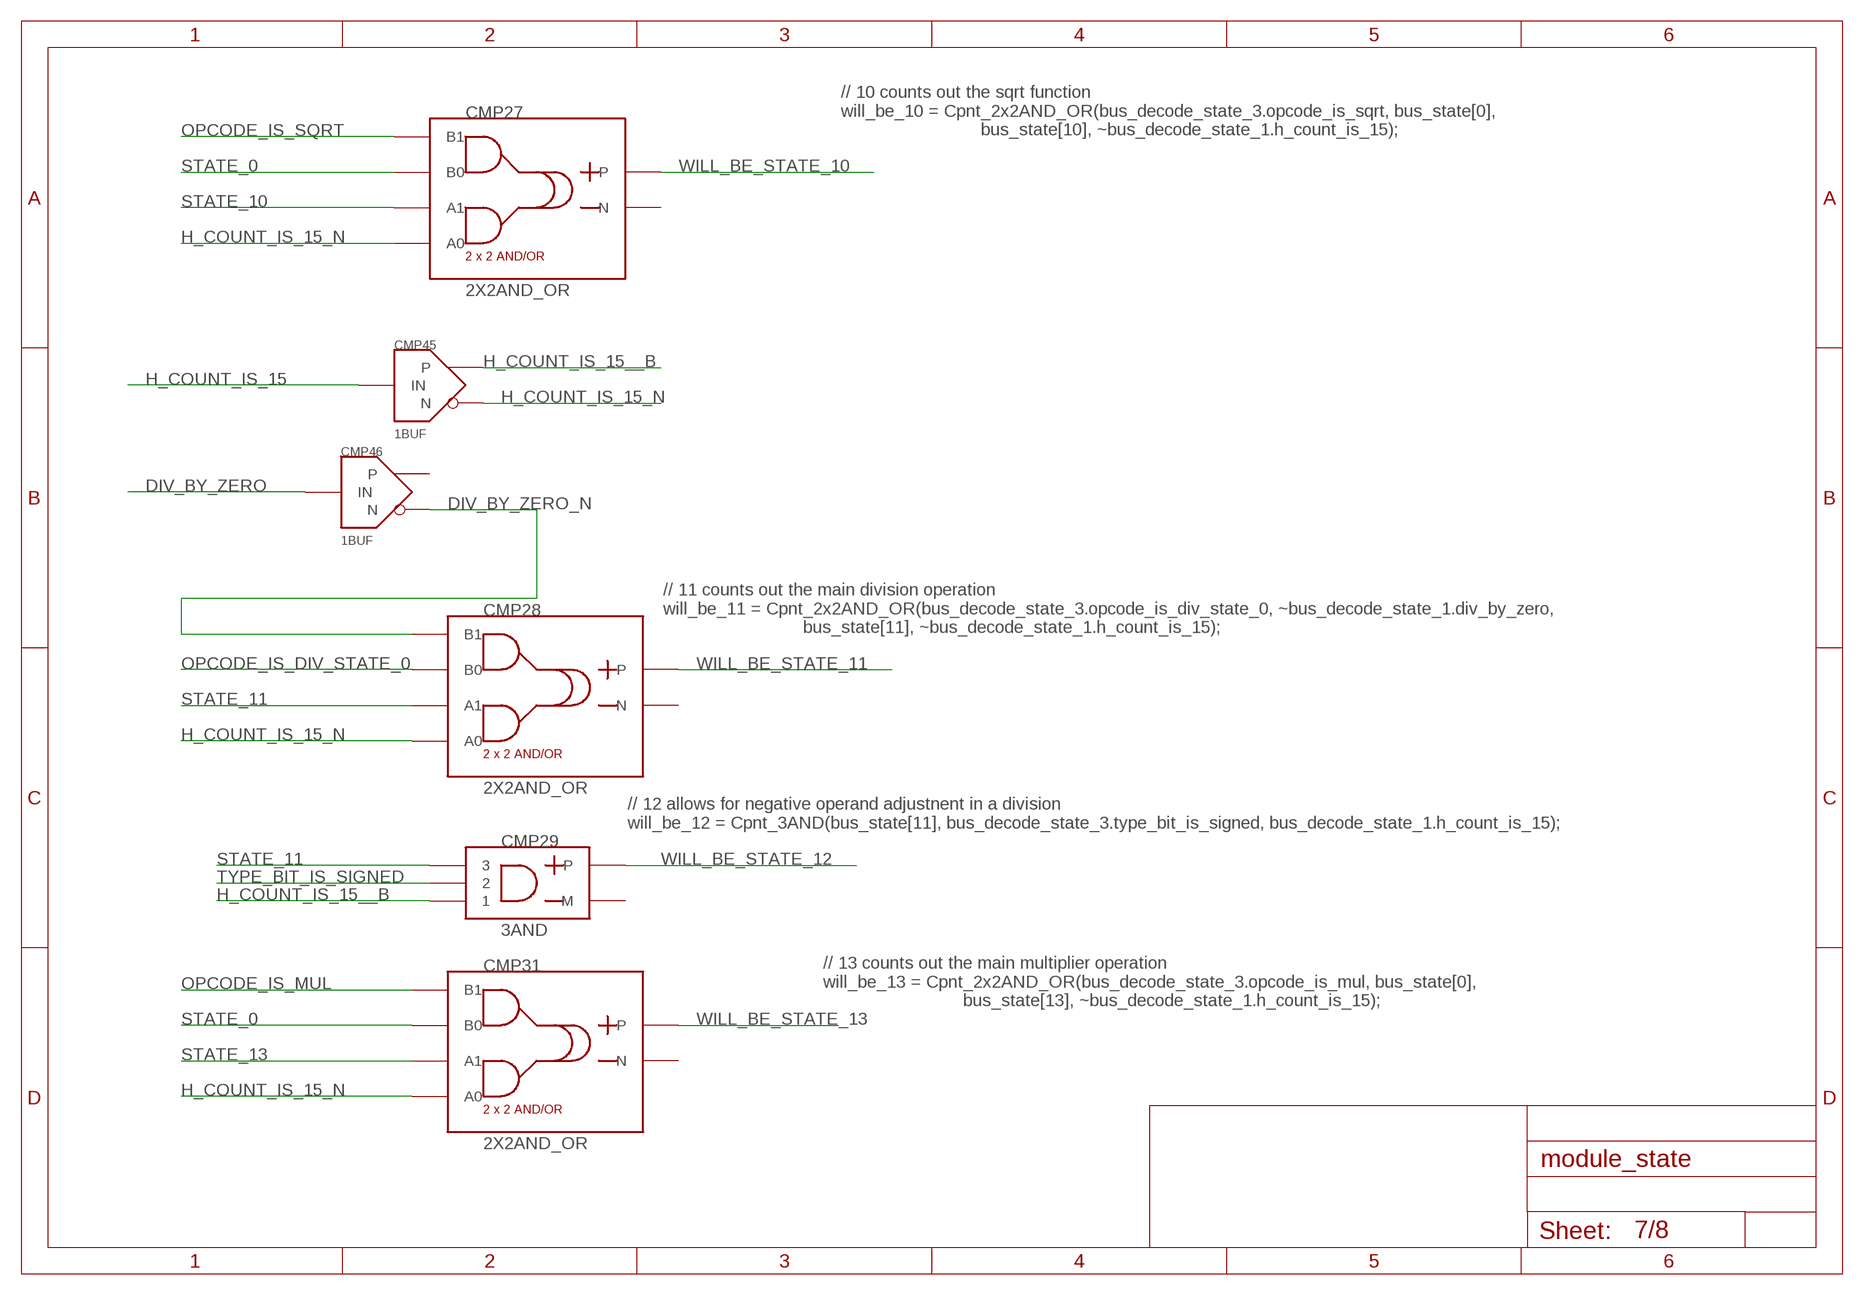
[diagram p6: schematic, sheet 7]

### Parts
CMP27  2X2AND_OR  [2X2AND_OR]
CMP28  2X2AND_OR  [2X2AND_OR]
CMP29  3AND  [3AND]
CMP31  2X2AND_OR  [2X2AND_OR]
CMP45  1BUF  [1BUF]
CMP46  1BUF  [1BUF]

### Nets
DIV_BY_ZERO: CMP46.IN ; also sheet 1,3
DIV_BY_ZERO_N: CMP28.P$4(B1) CMP46.N
H_COUNT_IS_15: CMP45.IN ; also sheet 1,5
H_COUNT_IS_15__B: CMP29.P$1 CMP45.P ; also sheet 8
H_COUNT_IS_15_N: CMP27.P$1(A0) CMP28.P$1(A0) CMP31.P$1(A0) CMP45.N
OPCODE_IS_DIV_STATE_0: CMP28.P$3(B0) ; also sheet 1
OPCODE_IS_MUL: CMP31.P$4(B1) ; also sheet 1
OPCODE_IS_SQRT: CMP27.P$4(B1) ; also sheet 1
STATE_0: CMP27.P$3(B0) CMP31.P$3(B0) ; also sheet 2,3,5,6,8
STATE_10: CMP27.P$2(A1) ; also sheet 2,5
STATE_11: CMP28.P$2(A1) CMP29.P$3 ; also sheet 2,5
STATE_13: CMP31.P$2(A1) ; also sheet 2,5,8
TYPE_BIT_IS_SIGNED: CMP29.P$2 ; also sheet 1,8
WILL_BE_STATE_10: CMP27.OUT_P(P) ; also sheet 2
WILL_BE_STATE_11: CMP28.OUT_P(P) ; also sheet 2
WILL_BE_STATE_12: CMP29.OUT_P(P) ; also sheet 2
WILL_BE_STATE_13: CMP31.OUT_P(P) ; also sheet 2
Unconnected: CMP27.OUT_M(N) CMP28.OUT_M(N) CMP29.OUT_M(M) CMP31.OUT_M(N) CMP46.P

### Notes on the sheet
- // 10 counts out the sqrt function
      will_be_10 = Cpnt_2x2AND_OR(bus_decode_state_3.opcode_is_sqrt, bus_state[0],
                                  bus_state[10], ~bus_decode_state_1.h_count_is_15);
- // 11 counts out the main division operation
      will_be_11 = Cpnt_2x2AND_OR(bus_decode_state_3.opcode_is_div_state_0, ~bus_decode_state_1.div_by_zero,
                                  bus_state[11], ~bus_decode_state_1.h_count_is_15);
- // 12 allows for negative operand adjustnent in a division
      will_be_12 = Cpnt_3AND(bus_state[11], bus_decode_state_3.type_bit_is_signed, bus_decode_state_1.h_count_is_15);
- // 13 counts out the main multiplier operation
      will_be_13 = Cpnt_2x2AND_OR(bus_decode_state_3.opcode_is_mul, bus_state[0],
                                  bus_state[13], ~bus_decode_state_1.h_count_is_15);

## Sheet 8 of 8
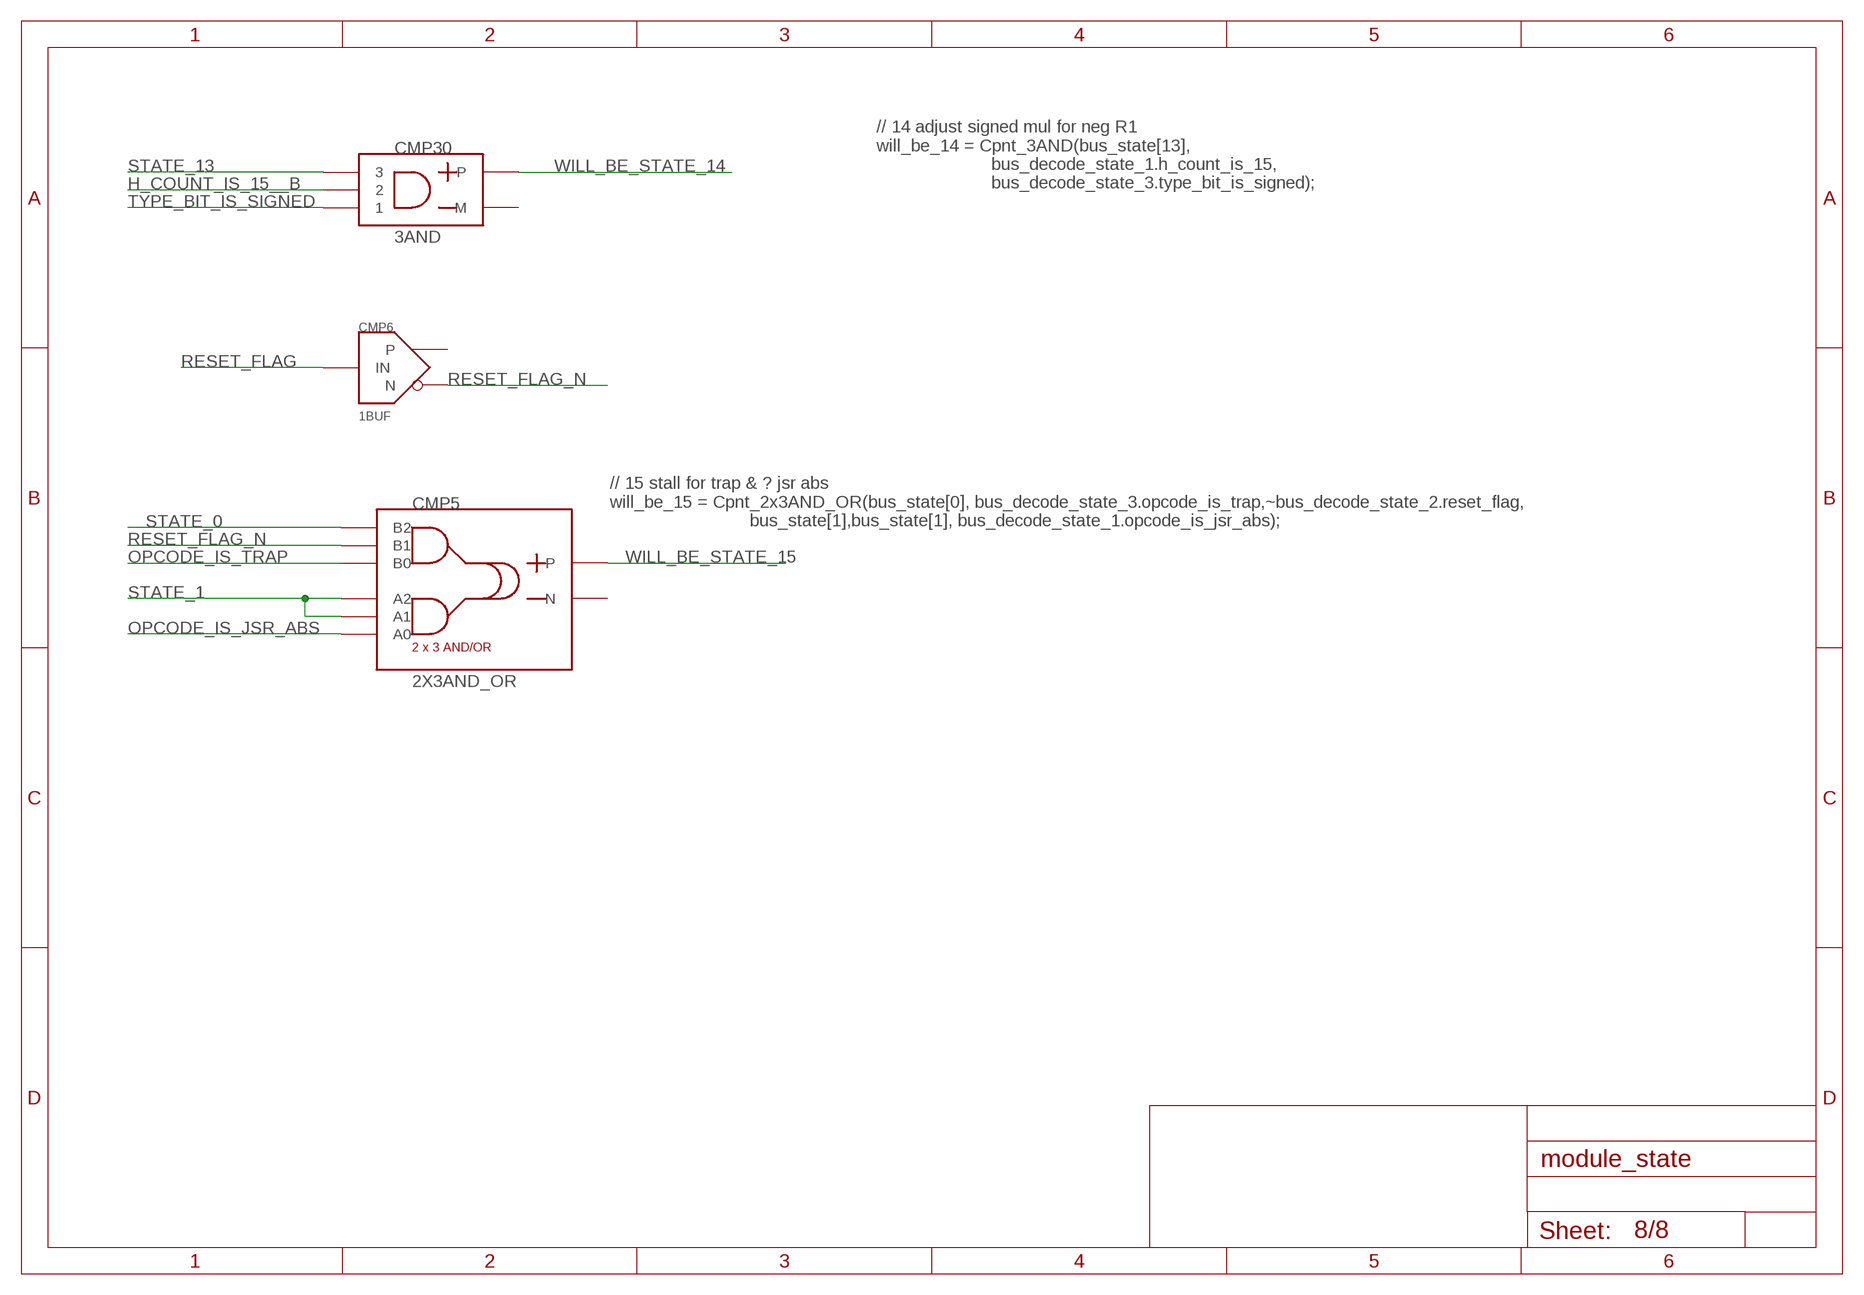
[diagram p7: schematic, sheet 8]

### Parts
CMP5  2X3AND_OR  [2X3AND_OR]
CMP6  1BUF  [1BUF]
CMP30  3AND  [3AND]

### Nets
H_COUNT_IS_15__B: CMP30.P$2 ; also sheet 7
OPCODE_IS_JSR_ABS: CMP5.P$1(A0) ; also sheet 1,3
OPCODE_IS_TRAP: CMP5.P$4(B0) ; also sheet 1
RESET_FLAG: CMP6.IN ; also sheet 1,4
RESET_FLAG_N: CMP5.P$5(B1) CMP6.N
STATE_0: CMP5.P$6(B2) ; also sheet 2,3,5,6,7
STATE_1: CMP5.P$2(A1) CMP5.P$3(A2) ; also sheet 2,3,5
STATE_13: CMP30.P$3 ; also sheet 2,5,7
TYPE_BIT_IS_SIGNED: CMP30.P$1 ; also sheet 1,7
WILL_BE_STATE_14: CMP30.OUT_P(P) ; also sheet 2
WILL_BE_STATE_15: CMP5.OUT_P(P) ; also sheet 2
Unconnected: CMP5.OUT_M(N) CMP6.P CMP30.OUT_M(M)

### Notes on the sheet
- // 14 adjust signed mul for neg R1
      will_be_14 = Cpnt_3AND(bus_state[13],
                             bus_decode_state_1.h_count_is_15,
                             bus_decode_state_3.type_bit_is_signed);
- // 15 stall for trap & ? jsr abs
      will_be_15 = Cpnt_2x3AND_OR(bus_state[0], bus_decode_state_3.opcode_is_trap,~bus_decode_state_2.reset_flag,
                                  bus_state[1],bus_state[1], bus_decode_state_1.opcode_is_jsr_abs);

## Library data of the parts
CMP1 CMP25 CMP27 CMP28 CMP31 = modules:2X2AND_OR
CMP2 CMP9 CMP86 CMP90 = modules:BUS_SPLIT_DISPLAY
CMP3 = modules:3OR
CMP4 = modules:5OR
CMP5 = modules:2X3AND_OR
CMP6 CMP8 CMP45 CMP46 = modules:1BUF
CMP7 = modules:BUS_CONSTRUCT
CMP10 = modules:BUS_CONSTRUCT_DISPLAY
CMP11 CMP21 = modules:2OR
CMP13 CMP26 = modules:2AND
CMP14 CMP23 = modules:8OR
CMP24 = modules:4X2AND_OR
CMP29 CMP30 = modules:3AND
CMP33 = modules:16REG
CMP34 = modules:STATUS
CMP36 = modules:BUS_TEE
CMP37 = modules:BUS_2_BUS
CMP39 = modules:2X16MUX
U$1 U$2 = modules:8X2AND_OR

## Board
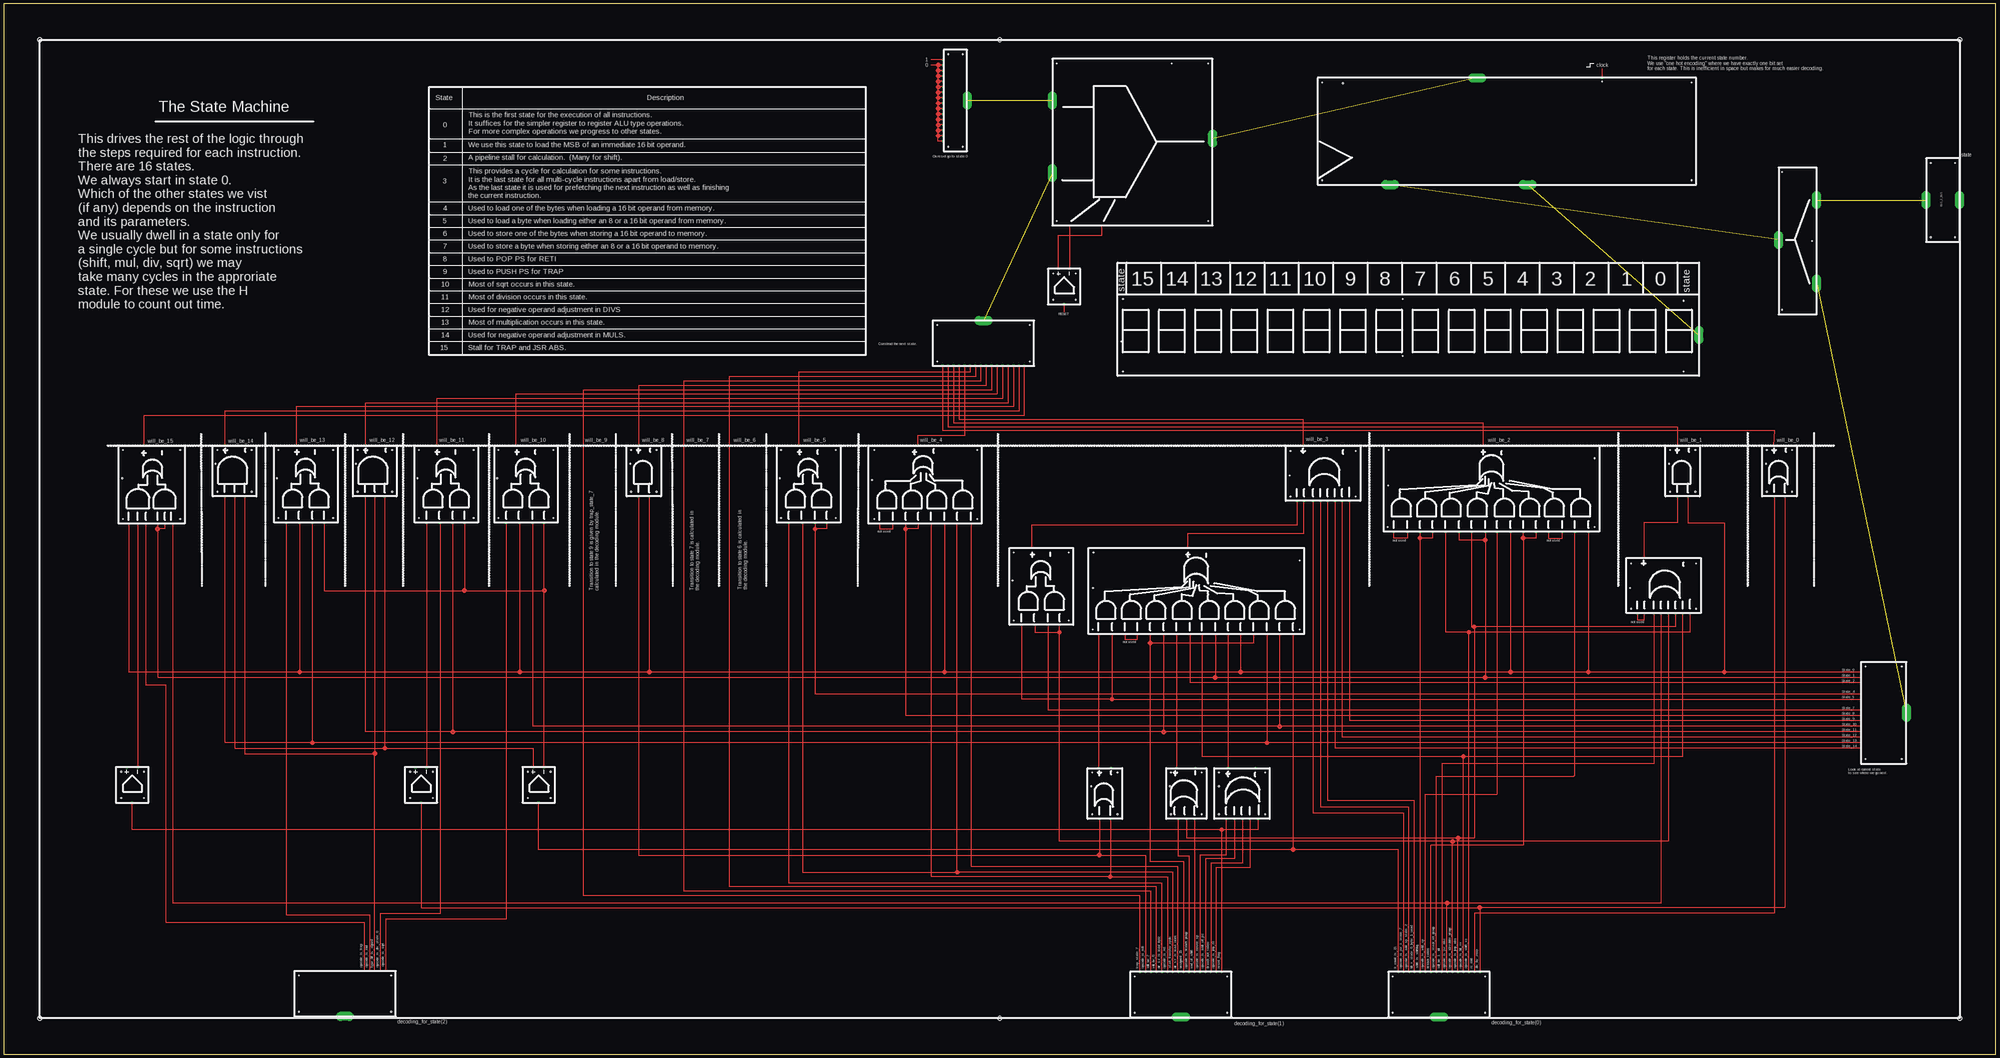
[diagram p8: board, top side]

Size 1397 x 736.6 mm. Coordinates in mm from the lower left corner, seen from the top.
Outline: 0,0 1397,0 1397,736.6 0,736.6 0,0
Copper layers (1*16): Top 0.035mm / dielectric 1.5mm / Bottom 0.035mm
Design rules "default": minimum track width 10mil, minimum drill 24mil, track to track 8mil, track to pad 8mil, pad to pad 8mil, via to via 8mil, smd to smd 8mil, copper to edge 40mil, drill to drill 8mil, minimum pad ring 10mil, minimum via ring 8mil, stop-mask expansion 4mil, vias tented up to drill 0mil, thermal gap 10mil
Holes 2.8 mm at 25.4,25.4 25.4,711.2 1371.6,711.2 1371.6,25.4 698.5,25.4 698.5,711.2
tKeepout: area 1362.5,16.3 to 1380.7,34.5; area 689.4,702.1 to 707.6,720.3; area 1362.5,702.1 to 1380.7,720.3; area 16.3,702.1 to 34.5,720.3; area 689.4,16.3 to 707.6,34.5; area 16.3,16.3 to 34.5,34.5

### Footprints (pad centres in the part's own frame; a part is rotated, then mirrored left to right if it is on the bottom)
2X2AND_OR = drill 0.8 square: OUT_M 27.94,-6.985; OUT_P 27.94,6.35; P$1 -26.035,-13.335; P$2 -26.035,-5.08; P$3 -26.035,3.81; P$4 -26.035,13.335 | hole 0.6: -22.86,18.733; 24.765,18.733; -22.86,-19.685; 24.765,-19.685; 5.08,19.685
BUS_SPLIT_DISPLAY = drill 0.8 pad 6.452 long: INPUT 0,15.24 | drill 0.8 square: P$1 -28.575,-16.51; P$2 -24.765,-16.51; P$3 -20.955,-16.51; P$4 -17.145,-16.51; P$5 -13.335,-16.51; P$6 -9.525,-16.51; P$7 -5.715,-16.51; P$8 -1.905,-16.51; P$9 1.905,-16.51; P$10 5.715,-16.51; P$11 9.525,-16.51; P$12 13.335,-16.51; P$13 17.145,-16.51; P$14 20.955,-16.51; P$15 24.765,-16.51; P$16 28.575,-16.51 | hole 0.6: -32.385,-13.335; -32.385,12.065; 32.385,12.065; 32.385,-13.335
3OR = drill 0.8 square: OUT_M 16.51,-6.985; OUT_P 16.51,6.35; P$1 -19.05,-6.35; P$2 -19.05,-0.635; P$3 -19.05,5.08 | hole 0.6: -15.875,-11.43; 13.335,-11.43; 13.335,10.16; -15.875,10.16; 3.81,10.795
5OR = drill 0.8 square: 1 -17.78,-10.795; 2 -17.78,-5.08; 3 -17.78,0; 4 -17.78,5.715; 5 -17.78,11.43; OUT_M 17.78,-8.89; OUT_P 17.78,10.16 | hole 0.6: -14.605,-15.875; 14.605,-15.875; 14.605,16.51; -14.605,16.51; 5.08,16.51
2X3AND_OR = drill 0.8 square: OUT_M 27.94,-6.985; OUT_P 27.94,5.715; P$1 -26.67,-14.605; P$2 -26.67,-8.89; P$3 -26.67,-3.81; P$4 -26.67,4.445; P$5 -26.67,10.16; P$6 -26.67,16.51 | hole 0.6: -23.495,-19.685; 24.765,-19.685; 24.765,20.32; -23.495,20.32; 5.08,20.955
1BUF = drill 0.8 square: IN -12.7,0; N 12.065,-3.81; P 12.065,3.81 | hole 0.6: -9.525,7.62; -9.525,-8.255; 8.89,-8.255; 8.89,7.62
BUS_SPLIT = drill 0.8 pad 6.452 long: INPUT -0.635,7.62 | drill 0.8 square: P$1 -29.21,-8.89; P$2 -25.4,-8.89; P$3 -21.59,-8.89; P$4 -17.78,-8.89; P$5 -13.97,-8.89; P$6 -10.16,-8.89; P$7 -6.35,-8.89; P$8 -2.54,-8.89; P$9 1.27,-8.89; P$10 5.08,-8.89; P$11 8.89,-8.89; P$12 12.7,-8.89; P$13 16.51,-8.89; P$14 20.32,-8.89; P$15 24.13,-8.89; P$16 27.94,-8.89 | hole 0.6: -33.02,-5.715; -33.02,4.445; 31.75,4.445; 31.75,-5.715
2OR = drill 0.8 square: OUT_M 17.78,-4.445; OUT_P 17.78,4.445; P$1 -17.78,-3.81; P$2 -17.78,3.81 | hole 0.6: -14.605,8.89; 14.605,-8.89; 14.605,8.89; -14.605,-8.89; 5.08,9.525
2AND = drill 0.8 square: OUT_M 19.05,-4.445; OUT_P 19.05,3.81; P$1 -16.51,-3.81; P$2 -16.51,3.81 | hole 0.6: -13.335,8.89; 15.875,-8.89; -13.335,-8.89; 15.875,8.89; 6.35,9.525
8OR = drill 0.8 square: 1 -21.59,-17.78; 2 -21.59,-12.7; 3 -21.59,-7.62; 4 -21.59,-2.54; 5 -21.59,2.54; 6 -21.59,7.62; 7 -21.59,13.97; 8 -21.59,19.05; OUT_M 17.145,-13.335; OUT_P 17.145,14.605 | hole 0.6: -18.415,-22.225; 13.335,-22.225; 13.335,23.495; -18.415,23.495; -3.81,24.13
4X2AND_OR = drill 0.8 square: OUT_M 26.67,-6.985; OUT_P 26.67,4.445; P$1 -27.94,-33.02; P$2 -27.94,-23.495; P$3 -27.94,-14.605; P$4 -27.94,-5.08; P$5 -27.94,3.81; P$6 -27.94,12.7; P$7 -27.94,21.59; P$8 -27.94,31.115 | hole 0.6: -24.765,-37.465; 23.495,-37.465; 23.495,34.608; -24.765,34.608; 2.54,36.195
3AND = drill 0.8 square: OUT_M 16.51,-7.62; OUT_P 16.51,6.985; P$1 -19.05,-6.985; P$2 -19.05,0; P$3 -19.05,6.985 | hole 0.6: -15.875,-12.065; 13.335,-12.065; 13.335,12.065; -15.875,12.065; 3.81,13.335
16REG = drill 0.8 pad 6.452 long: DISPLAY 17.78,-33.02; INPUT -17.78,41.91; OUT -78.74,-33.02 | drill 0.8 square: P$1 69.85,41.91 | hole 0.6: -126.365,-29.845; -126.365,38.735; 132.715,38.735; 132.715,-29.845; -111.76,38.1; 69.85,39.37
STATUS = drill 0.8 pad 6.452 long: P$1 208.28,-2.54 | hole 0.6: -195.58,-27.94; -195.58,22.86; 197.485,-27.94; 197.485,21.59; 0.635,22.86; 0.635,-17.145; -196.85,-6.985
BUS_TEE = drill 0.8 pad 6.452 long: INPUT 0,15.24; OUT_A -30.48,-11.43; OUTB 27.94,-11.43 | hole 0.6: -48.895,12.7; -0.635,-8.255; 47.625,12.7
BUS2BUS = drill 0.8 pad 6.452 long: P$1 -1.27,12.7; P$2 -1.27,-10.795 | hole 0.6: -27.305,-7.62; -27.305,9.525; 24.765,9.525; 24.765,-7.62
2X16MUX = drill 0.8 square: EN0 -57.15,38.1; EN1 -57.15,15.24 | drill 0.8 pad 6.452 long: OUT 3.81,-62.23; PORT0 -20.32,50.165; PORT1 30.48,50.165 | hole 0.6: 56.515,46.99; -53.975,46.99; -53.975,-59.055; 56.515,-59.055; 56.515,-33.655
8X2AND_OR = drill 0.8 square: OUT_M 29.845,-8.89; OUT_P 29.845,3.81; P$1 -30.48,-69.85; P$2 -30.48,-60.325; P$3 -30.48,-51.435; P$4 -30.48,-41.91; P$5 -30.48,-33.02; P$6 -30.48,-24.13; P$7 -30.48,-15.24; P$8 -30.48,-5.715; P$9 -30.48,2.54; P$10 -30.48,12.065; P$11 -30.48,20.955; P$12 -30.48,30.48; P$13 -30.48,39.37; P$14 -30.48,48.26; P$15 -30.48,57.15; P$16 -30.48,66.675 | hole 0.6: -27.305,-74.295; 20.955,-74.295; 26.67,70.168; -27.305,70.802; 1.905,70.485

### Placement (x,y rotation side)
CMP1  727.08,327.02 90 top
CMP2  1006.48,41.27 180 top
CMP3  828.67,184.15 90 top
CMP4  868.68,182.88 90 top
CMP5  104.14,398.78 90 top
CMP6  90.17,189.23 90 top
CMP7  668.02,668.02 270 top
CMP8  743.59,538.48 90 top
CMP9  1318.89,239.4 270 top
CMP10  687.07,499.11 0 top
CMP11  1245.23,408.94 90 top
CMP13  1177.29,407.67 90 top
CMP14  1164.59,330.83 90 top
CMP21  772.16,182.88 90 top
CMP23  925.83,409.57 90 top
CMP24  645.16,400.05 90 top
CMP25  563.88,398.78 90 top
CMP26  448.94,407.67 90 top
CMP27  365.76,398.78 90 top
CMP28  309.88,398.78 90 top
CMP29  260.35,410.21 90 top
CMP30  161.93,410.21 90 top
CMP31  211.46,398.78 90 top
CMP33  1050.92,642.62 0 top
CMP34  980.44,506.73 0 top
CMP36  1259.84,570.87 90 top
CMP37  1360.81,600.08 90 top
CMP39  785.5,638.17 90 top
CMP45  375.29,189.23 90 top
CMP46  292.74,189.23 90 top
CMP86  825.5,41.27 180 top
CMP90  239.4,41.91 180 top
U$1  1041.4,396.88 90 top
U$2  834.39,325.12 90 top

### Tracks (layer width: path | path; a pad name or v marks a point on that pad's centre or on a via)
BRANCH_NOT_TAKEN
  Top 0.61: CMP4.3 868.68,133.99 846.46,133.99 CMP86.P$3
BRANCH_TAKEN
  Top 0.61: U$1.P$5 1074.42,361.95 1065.53,361.95 | 1065.53,361.95 U$1.P$6 | 1065.53,361.95 1065.53,146.69 1000.76,146.69 CMP2.P$10
DIR_SZ_IS_LOAD_BYTE
  Top 0.61: CMP86.P$12 812.16,120.02 550.54,120.02 CMP25.P$4
DIR_SZ_IS_LOAD_WORD
  Top 0.61: CMP24.P$1 678.18,131.44 823.6,131.44 CMP86.P$9
DIV_BY_ZERO
  Top 0.61: CMP11.P$1 1249.05,102.87 1035.05,102.87 | CMP46.IN 292.74,102.87 1035.05,102.87 | 1035.05,102.87 CMP2.P$1
DIV_BY_ZERO_N
  Top 0.61: CMP28.P$4 CMP46.N
END_ABSOLUTE
  Top 0.61: CMP23.8 906.78,370.84 720.73,370.84 CMP1.OUT_P
END_OF_SHIFT
  Top 0.61: CMP3.P$1 CMP86.P$6
H_COUNT_IS_15
  Top 0.61: U$2.P$1 904.24,143.51 | CMP2.P$16 977.9,143.51 904.24,143.51 | 904.24,143.51 375.29,143.51 CMP45.IN
H_COUNT_IS_15__B
  Top 0.61: CMP29.P$1 267.33,214.63 | 267.33,214.63 371.48,214.63 CMP45.P | CMP30.P$2 161.93,214.63 267.33,214.63
H_COUNT_IS_15_N
  Top 0.61: CMP45.N 379.1,325.12 | 379.1,325.12 CMP27.P$1 | CMP31.P$1 224.79,325.12 323.21,325.12 | 323.21,325.12 379.1,325.12 | CMP28.P$1 323.21,325.12
IS_END
  Top 0.61: CMP11.P$2 1241.42,99.06 1031.24,99.06 CMP2.P$2
LDI_X_STATE_0_BYTE_1_WORD
  Top 0.61: CMP23.4 928.37,177.8 989.33,177.8 CMP2.P$13
N$1  (1 unrouted)
N$2  (1 unrouted)
N$3  (1 unrouted)
N$5
  Top 0.61: CMP7.P$2 655.32,693.42 | 655.32,693.42 650.24,693.42 | CMP7.P$16 655.32,640.08 655.32,643.89 | 655.32,643.89 655.32,647.7 | 655.32,647.7 655.32,651.51 | 655.32,651.51 655.32,655.32 | 655.32,655.32 655.32,659.13 | 655.32,659.13 655.32,662.94 | 655.32,662.94 655.32,666.75 | 655.32,666.75 655.32,670.56 | 655.32,670.56 655.32,674.37 | 655.32,674.37 655.32,678.18 | 655.32,678.18 655.32,681.99 | 655.32,681.99 655.32,685.8 | 655.32,685.8 655.32,689.61 | 655.32,689.61 655.32,693.42 | CMP7.P$3 655.32,689.61 | CMP7.P$4 655.32,685.8 | CMP7.P$5 655.32,681.99 | CMP7.P$6 655.32,678.18 | CMP7.P$7 655.32,674.37 | CMP7.P$8 655.32,670.56 | CMP7.P$9 655.32,666.75 | CMP7.P$15 655.32,643.89 | CMP7.P$14 655.32,647.7 | CMP7.P$13 655.32,651.51 | CMP7.P$12 655.32,655.32 | CMP7.P$11 655.32,659.13 | CMP7.P$10 655.32,662.94
N$7  (1 unrouted)
N$8  (1 unrouted)
N$9  (1 unrouted)
N$10  (1 unrouted)
  Top 0.61: U$1.P$15 984.25,361.95 974.73,361.95 U$1.P$16 | U$1.P$4 1083.31,361.95 1092.84,361.95 U$1.P$3
N$11
  Top 0.61: CMP14.8 1145.54,304.8 1150.62,304.8 CMP14.7
N$12
  Top 0.61: 658.5,697.23 650.24,697.23
N$13
  Top 0.61: CMP8.P 739.77,574.04 770.25,574.04 CMP39.EN1
N$14
  Top 0.61: CMP24.P$8 614.04,368.3 623.57,368.3 CMP24.P$7
N$15
  Top 0.61: U$2.P$14 786.13,290.83 795.02,290.83 U$2.P$13
N$16
  Top 0.61: 1120.78,690.88 1120.78,685.8
OPCODE_IS_ABSOLUTE_GROUP
  Top 0.61: CMP1.P$3 723.26,295.91 740.41,295.91 | 740.41,295.91 CMP1.P$1 | CMP14.4 1167.13,149.22 1016,149.22 | 1016,149.22 740.41,149.22 740.41,295.91 | CMP2.P$6 1016,149.22
OPCODE_IS_ADD_SP
  Top 0.61: U$1.P$8 1047.12,182.25 996.95,182.25 CMP2.P$11
OPCODE_IS_ADD_SP_STATE_2
  Top 0.61: CMP23.5 923.29,173.35 985.52,173.35 CMP2.P$14
OPCODE_IS_ANDI_ORI_PS
  Top 0.61: CMP4.4 862.97,137.16 842.64,137.16 CMP86.P$4
OPCODE_IS_BIT_XX
  Top 0.61: U$2.P$8 840.11,208.91 1023.62,208.91 | 1023.62,208.91 1177.29,208.91 CMP14.2 | CMP2.P$4 1023.62,208.91
OPCODE_IS_BRANCH_GROUP
  Top 0.61: CMP3.P$3 823.6,139.06 831.22,139.06 CMP86.P$7
OPCODE_IS_DIV_STATE_0
  Top 0.61: CMP28.P$3 306.07,98.42 264.16,98.42 CMP90.P$2
OPCODE_IS_JMP_ABS
  Top 0.61: U$1.P$10 1029.34,299.72 1031.24,299.72 | 1031.24,299.72 1031.24,151.76 1019.81,151.76 | CMP3.P$2 829.31,151.76 1019.81,151.76 | CMP14.3 1172.21,299.72 1031.24,299.72 | CMP2.P$5 1019.81,151.76
OPCODE_IS_JMP_R0
  Top 0.61: CMP4.2 873.76,130.81 850.26,130.81 CMP86.P$2
OPCODE_IS_JSR_ABS
  Top 0.61: CMP5.P$1 118.75,106.05 1012.19,106.05 | CMP14.5 1162.05,106.05 1012.19,106.05 | CMP2.P$7 1012.19,106.05
OPCODE_IS_JSR_X_STATE_7
  Top 0.61: CMP23.6 918.21,168.91 981.71,168.91 CMP2.P$15
OPCODE_IS_MOVER_SP
  Top 0.61: CMP4.5 857.25,139.7 838.84,139.7 CMP86.P$5
OPCODE_IS_MUL
  Top 0.61: CMP31.P$4 198.12,97.79 256.54,97.79 CMP90.P$4
OPCODE_IS_RET
  Top 0.61: CMP21.P$1 775.97,124.46 | CMP24.P$4 650.24,124.46 775.97,124.46 | 775.97,124.46 815.98,124.46 CMP86.P$11
OPCODE_IS_RETI
  Top 0.61: CMP21.P$2 768.35,139.7 | 768.35,139.7 800.74,139.7 CMP86.P$15 | CMP26.P$2 445.13,139.7 768.35,139.7
OPCODE_IS_SHIFT_XX
  Top 0.61: U$1.P$12 1010.92,295.91 1027.43,295.91 | CMP14.1 1182.37,295.91 1027.43,295.91 | CMP2.P$3 1027.43,295.91
OPCODE_IS_SQRT
  Top 0.61: CMP27.P$4 352.43,94.61 267.97,94.61 CMP90.P$1
OPCODE_IS_STACK_REL_GROUP
  Top 0.61: CMP2.P$9 1004.57,194.94 1101.09,194.94 1101.72,195.58 U$1.P$2
OPCODE_IS_TRAP
  Top 0.61: CMP5.P$4 99.69,259.08 113.67,259.08 113.67,92.71 252.73,92.71 CMP90.P$5
RESET_FLAG
  Top 0.61: CMP4.1 879.48,157.48 854.08,157.48 | 854.08,157.48 CMP86.P$1 | 854.08,157.48 90.17,157.48 CMP6.IN
RESET_FLAG_N
  Top 0.61: CMP5.P$5 CMP6.N
RESET_IN
  Top 0.61: CMP8.IN 743.59,520.7
RESET_N
  Top 0.61: CMP39.EN0 CMP8.N
RESET_VAL  (1 unrouted)
SHIFT_IS_SHIFTING
  Top 0.61: U$1.P$14 993.14,361.95 | 993.14,361.95 CMP2.P$12 | U$1.P$13 1002.03,361.95 993.14,361.95
START_TRANSFER_CYCLE
  Top 0.61: CMP25.P$3 560.07,127.64 668.65,127.64 | 668.65,127.64 CMP24.P$2 | CMP86.P$10 819.78,127.64 668.65,127.64
STATE_0
  Top 0.61: 1206.5,267.97 1111.25,267.97 | 1111.25,267.97 1056.64,267.97 | 1056.64,267.97 867.41,267.97 | 867.41,267.97 659.76,267.97 | 659.76,267.97 452.75,267.97 | 452.75,267.97 361.95,267.97 | 361.95,267.97 207.65,267.97 | 207.65,267.97 87.63,267.97 CMP5.P$6 | U$1.P$1 1111.25,267.97 | CMP13.P$1 1181.1,372.75 1206.5,372.75 1206.5,267.97 | CMP26.P$1 452.75,267.97 | CMP27.P$3 361.95,267.97 | CMP31.P$3 207.65,267.97 | CMP24.P$3 659.76,267.97 | U$1.P$7 1056.64,267.97 | U$2.P$5 867.41,267.97 | CMP9.P$1 1206.5,267.97
STATE_1
  Top 0.61: 1038.86,264.16 849.63,264.16 | 849.63,264.16 107.95,264.16 107.95,368.3 | U$1.P$9 1038.86,360.68 | 1038.86,360.68 1038.86,264.16 | U$2.P$7 849.63,264.16 | CMP5.P$3 107.95,368.3 | U$1.P$11 1020.45,360.68 1038.86,360.68 | CMP5.P$2 113.03,368.3 107.95,368.3 | CMP9.P$2 1038.86,264.16
STATE_2
  Top 0.61: U$2.P$9 831.85,260.35 CMP9.P$3
STATE_4
  Top 0.61: CMP25.P$2 568.96,368.3 | 568.96,368.3 568.96,252.73 CMP9.P$5 | CMP25.P$1 577.22,368.3 568.96,368.3
STATE_5
  Top 0.61: 777.24,248.92 713.74,248.92 CMP1.P$4 | U$2.P$15 777.24,248.92 | 777.24,248.92 CMP9.P$6
STATE_7
  Top 0.61: CMP1.P$2 732.15,241.3 CMP9.P$8
STATE_8
  Top 0.61: CMP24.P$6 632.46,368.3 | 632.46,368.3 632.46,237.49 CMP9.P$9 | CMP24.P$5 641.35,368.3 632.46,368.3
STATE_9
  Top 0.61: CMP23.1 943.61,233.68 CMP9.P$10
STATE_10
  Top 0.61: 894.72,229.87 370.84,229.87 CMP27.P$2 | U$2.P$2 894.72,229.87 | CMP9.P$11 894.72,229.87
STATE_11
  Top 0.61: 813.43,226.06 314.96,226.06 | 314.96,226.06 253.37,226.06 CMP29.P$3 | U$2.P$11 813.43,226.06 | CMP28.P$2 314.96,226.06 | CMP9.P$12 813.43,226.06
STATE_12
  Top 0.61: CMP23.2 938.53,222.25 CMP9.P$13
STATE_13
  Top 0.61: 885.83,218.44 216.53,218.44 | 216.53,218.44 154.94,218.44 CMP30.P$3 | U$2.P$3 885.83,218.44 | CMP31.P$2 216.53,218.44 | CMP9.P$14 885.83,218.44
STATE_14
  Top 0.61: CMP23.3 933.45,214.63 CMP9.P$15
TRAP_STATE_7
  Top 0.61: CMP86.P$16 796.92,111.12 406.4,111.12 406.4,465.45 692.78,465.45 CMP10.P$10
TYPE_BIT_IS_SIGNED
  Top 0.61: CMP29.P$2 260.35,210.82 | CMP30.P$1 168.91,210.82 260.35,210.82 | CMP90.P$3 260.35,210.82
UNSIGNED_15
  Top 0.61: U$2.P$12 803.91,288.29 | 803.91,288.29 803.91,135.25 827.4,135.25 CMP86.P$8 | U$2.P$4 876.3,288.29 803.91,288.29
WILL_BE_1__LDI
  Top 0.61: CMP14.6 1156.97,203.84 1008.38,203.84 CMP2.P$8
WILL_BE_1__OPTIONS
  Top 0.61: CMP13.P$2 1173.48,372.75 1149.98,372.75 CMP14.OUT_P
WILL_BE_3__FROM_0
  Top 0.61: U$2.P$6 CMP4.OUT_P
WILL_BE_3__FROM_2
  Top 0.61: U$2.P$10 CMP3.OUT_P
WILL_BE_3__FROM_5
  Top 0.61: U$2.P$16 CMP21.OUT_P
WILL_BE_3__FROM_MANY
  Top 0.61: U$2.OUT_P 830.58,365.12 911.86,365.12 CMP23.7
WILL_BE_STATE_0
  Top 0.61: CMP11.OUT_P 1241.42,437.51 658.5,437.51 CMP10.P$1
WILL_BE_STATE_1
  Top 0.61: CMP13.OUT_P 1173.48,440.06 662.3,440.06 CMP10.P$2
WILL_BE_STATE_2
  Top 0.61: U$1.OUT_P 1037.59,442.6 666.12,442.6 CMP10.P$3
WILL_BE_STATE_3
  Top 0.61: CMP23.OUT_P 911.23,445.13 669.92,445.13 CMP10.P$4
WILL_BE_STATE_4
  Top 0.61: CMP24.OUT_P 640.72,433.7 673.74,433.7 CMP10.P$5
WILL_BE_STATE_5
  Top 0.61: CMP25.OUT_P 557.53,478.15 677.54,478.15 CMP10.P$6
WILL_BE_STATE_6
  Top 0.61: CMP86.P$13 808.36,117.47 508.63,117.47 508.63,474.98 681.36,474.98 CMP10.P$7
WILL_BE_STATE_7
  Top 0.61: CMP86.P$14 804.54,114.3 476.88,114.3 476.88,471.81 685.16,471.81 CMP10.P$8
WILL_BE_STATE_8
  Top 0.61: CMP26.OUT_P 445.13,468.63 688.98,468.63 CMP10.P$9
WILL_BE_STATE_10
  Top 0.61: CMP27.OUT_P 359.41,462.92 696.6,462.92 CMP10.P$11
WILL_BE_STATE_11
  Top 0.61: CMP28.OUT_P 303.53,459.74 700.4,459.74 CMP10.P$12
WILL_BE_STATE_12
  Top 0.61: CMP29.OUT_P 253.37,456.56 704.22,456.56 CMP10.P$13
WILL_BE_STATE_13
  Top 0.61: CMP31.OUT_P 205.1,454.02 708.02,454.02 CMP10.P$14
WILL_BE_STATE_14
  Top 0.61: CMP30.OUT_P 154.94,450.85 711.84,450.85 CMP10.P$15
WILL_BE_STATE_15
  Top 0.61: CMP5.OUT_P 98.42,447.68 715.64,447.68 CMP10.P$16
(copper drawn outside any net)
  shapes: Top circle x54

### Text on the board
tPlace: 1 | 0 | clock | This register holds the current state number. / We use "one hot encoding" where we have exactly one bit set / for each state. This is inefficient in space but makes for much easier decoding. | State | Description | The State Machine | 0 | This is the first state for the execution of all instructions. / It suffices for the simpler register to register ALU type operations. / For more complex operations we progress to other states. | 1 | We use this state to load the MSB of an immediate 16 bit operand. | On reset go to state 0 | state | A pipeline stall for calculation. (Many for shift). | 2 | 3 | This provides a cycle for calculation for some instructions. / It is the last state for all multi-cycle instructions apart from load/store. / As the last state it is used for prefetching the next instruction as well as finishing / the current instruction. | 4 | Used to load one of the bytes when loading a 16 bit operand from memory. | 5 | Used to load a byte when loading either an 8 or a 16 bit operand from memory. | 6 | Used to store one of the bytes when storing a 16 bit operand to memory. | 7 | Used to store a byte when storing either an 8 or a 16 bit operand to memory. | 8 | Used to POP PS for RETI | 9 | Used to PUSH PS for TRAP | 10 | Most of sqrt occurs in this state. | 15 | 14 | 13 | 12 | 11 | 10 | 9 | 8 | 7 | 6 | 5 | 4 | 3 | 2 | 1 | 0 | state | state | 11 | Most of division occurs in this state. | This drives the rest of the logic through / the steps required for each instruction. / There are 16 states. / We always start in state 0. / Which of the other states we vist / (if any) depends on the instruction / and its parameters. / We usually dwell in a state only for / a single cycle but for some instructions / (shift, mul, div, sqrt) we may / take many cycles in the approriate / state. For these we use the H / module to count out time. | 12 | Used for negative operand adjustment in DIVS | RESET | 13 | Most of multiplication occurs in this state. | 14 | Used for negative operand adjustment in MULS. | Construct the next state. | 15 | Stall for TRAP and JSR ABS. | will_be_3 | will_be_15 | will_be_14 | will_be_13 | will_be_12 | will_be_11 | will_be_10 | will_be_9 | will_be_8 | will_be_7 | will_be_6 | will_be_5 | will_be_4 | will_be_2 | will_be_1 | will_be_0 | not used | not used | not used | Transition to state 6 is calculated in / the decoding module. | Transition to state 9 is given by trap_state_7 / calculated in the decoding module. | Transition to state 7 is calculated in / the decoding module. | not used | not used | State_0 | State_1 | State_2 | State_4 | State_5 | State_7 | State_8 | State_9 | State_10 | State_11 | State_12 | State_13 | State_14 | Look at current state / to see where we go next. | opcode_is_sqrt | opcode_is_trap | opcode_is_mul | type_bit_is_signed | opcode_is_div_state_0 | trap_state_7 | opcode_is_reti | will_be_7 | will_be_6 | dir_sz_is_load_byte | opcode_is_ret | start_transfer_cycle | dir_sz_is_load_word | unsigned_15 | opcode_is_branch_group | end_of_shift | opcode_is_mover_sp | opcode_is_andi_ori_ps | branch_not_taken | opcode_is_jmp_r0 | reset_flag | h_count_is_15 | opcode_is_jsr_x_state_7 | opcode_is_add_sp_state_2 | ldi_x_state_0_byte_1_word | shift_is_shifting | opcode_is_add_sp | branch_taken | opcode_is_stack_rel_group | will_be_1__ldi | opcode_is_jsr_abs | opcode_is_absolute_group | opcode_is_jmp_abs | opcode_is_bit_xx | opcode_is_shift_xx | is_end | div_by_zero | decoding_for_state(2) | decoding_for_state(0) | decoding_for_state(1)